# EAGLE design LRA_FlightComputerV (EAGLE 8.7.1)
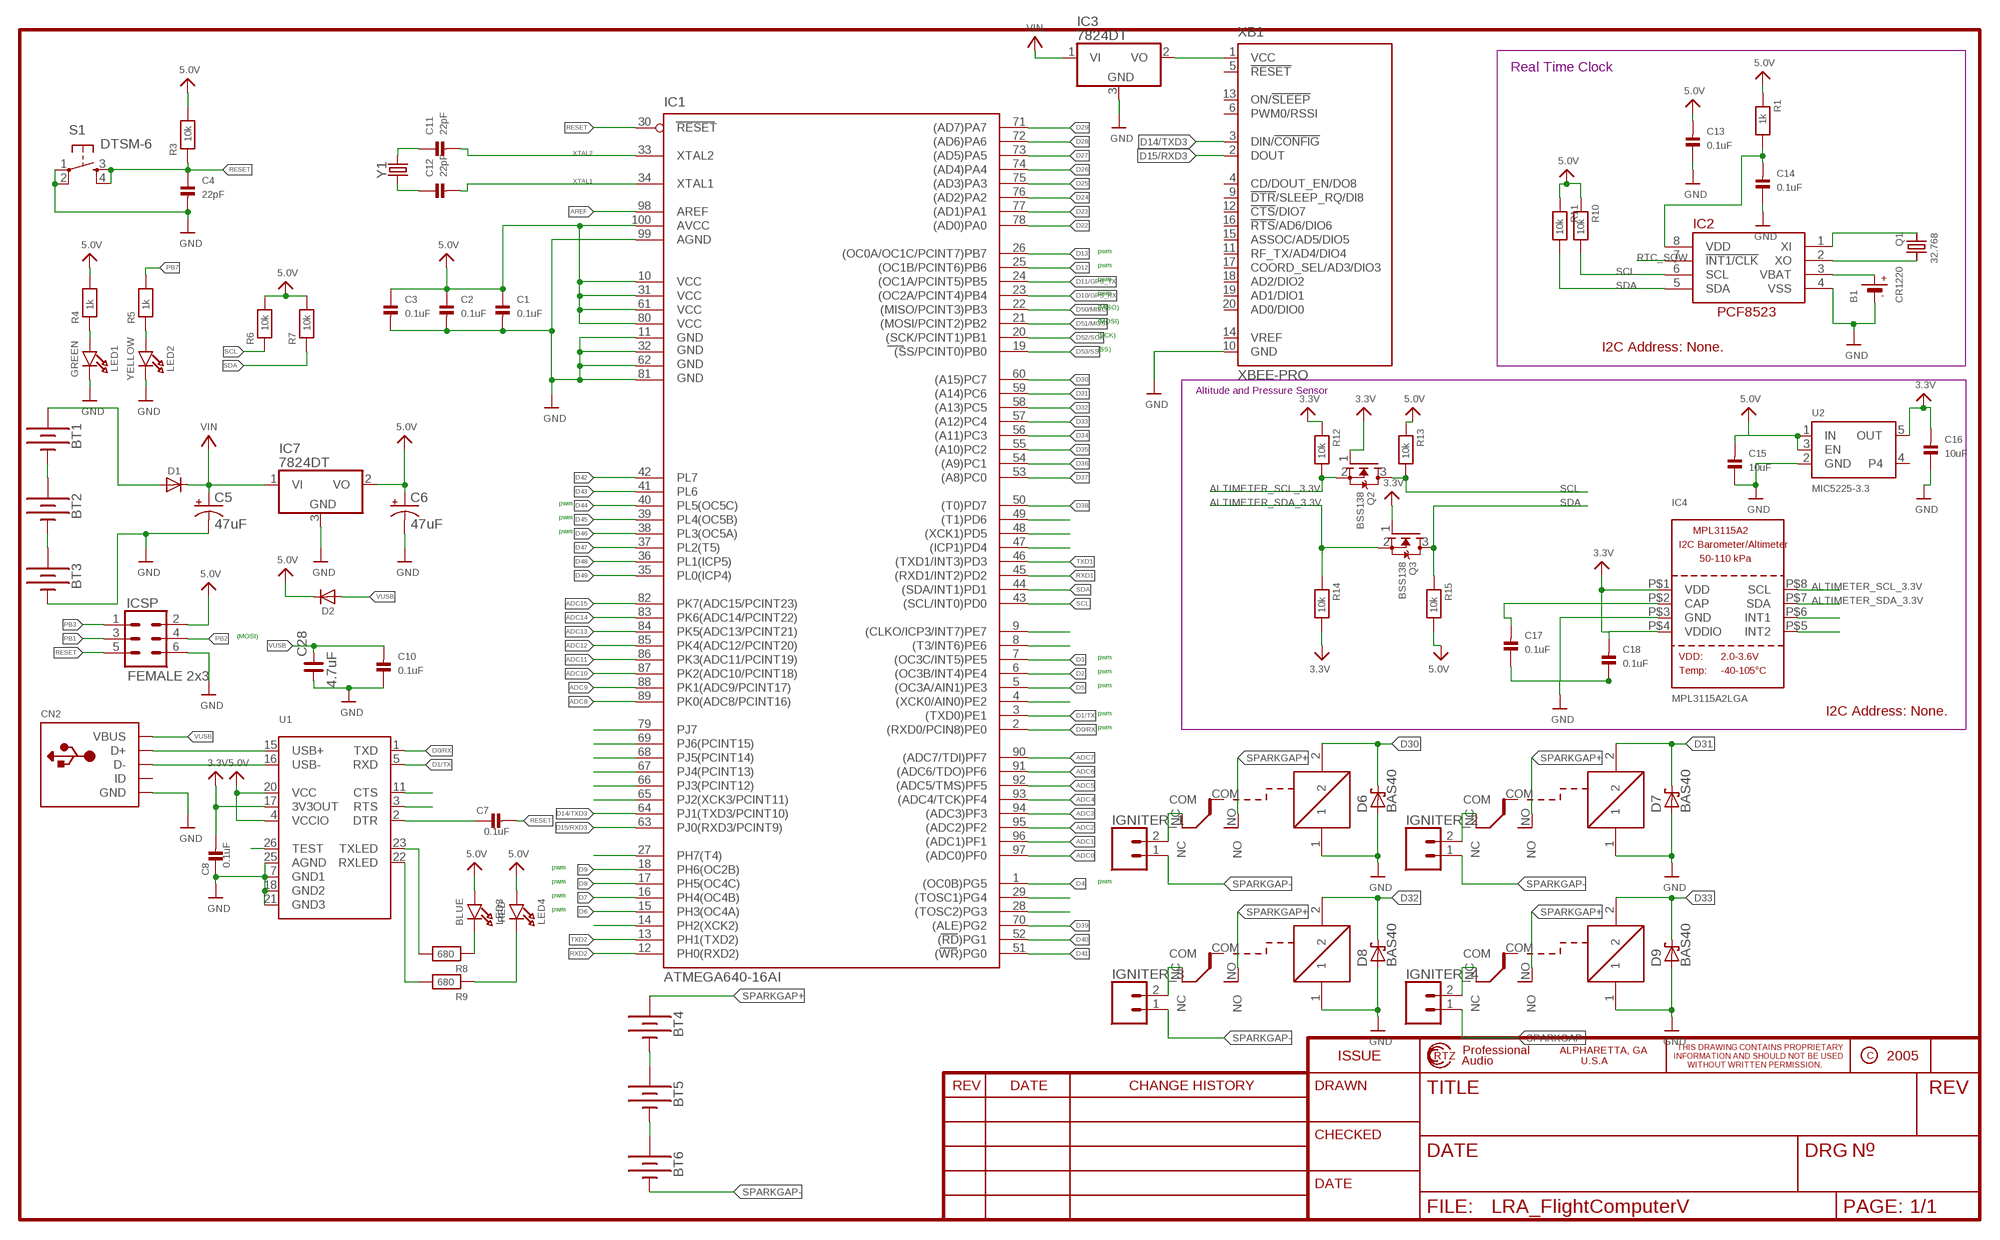
[diagram p0: schematic, sheet 1, part 1 of 2]
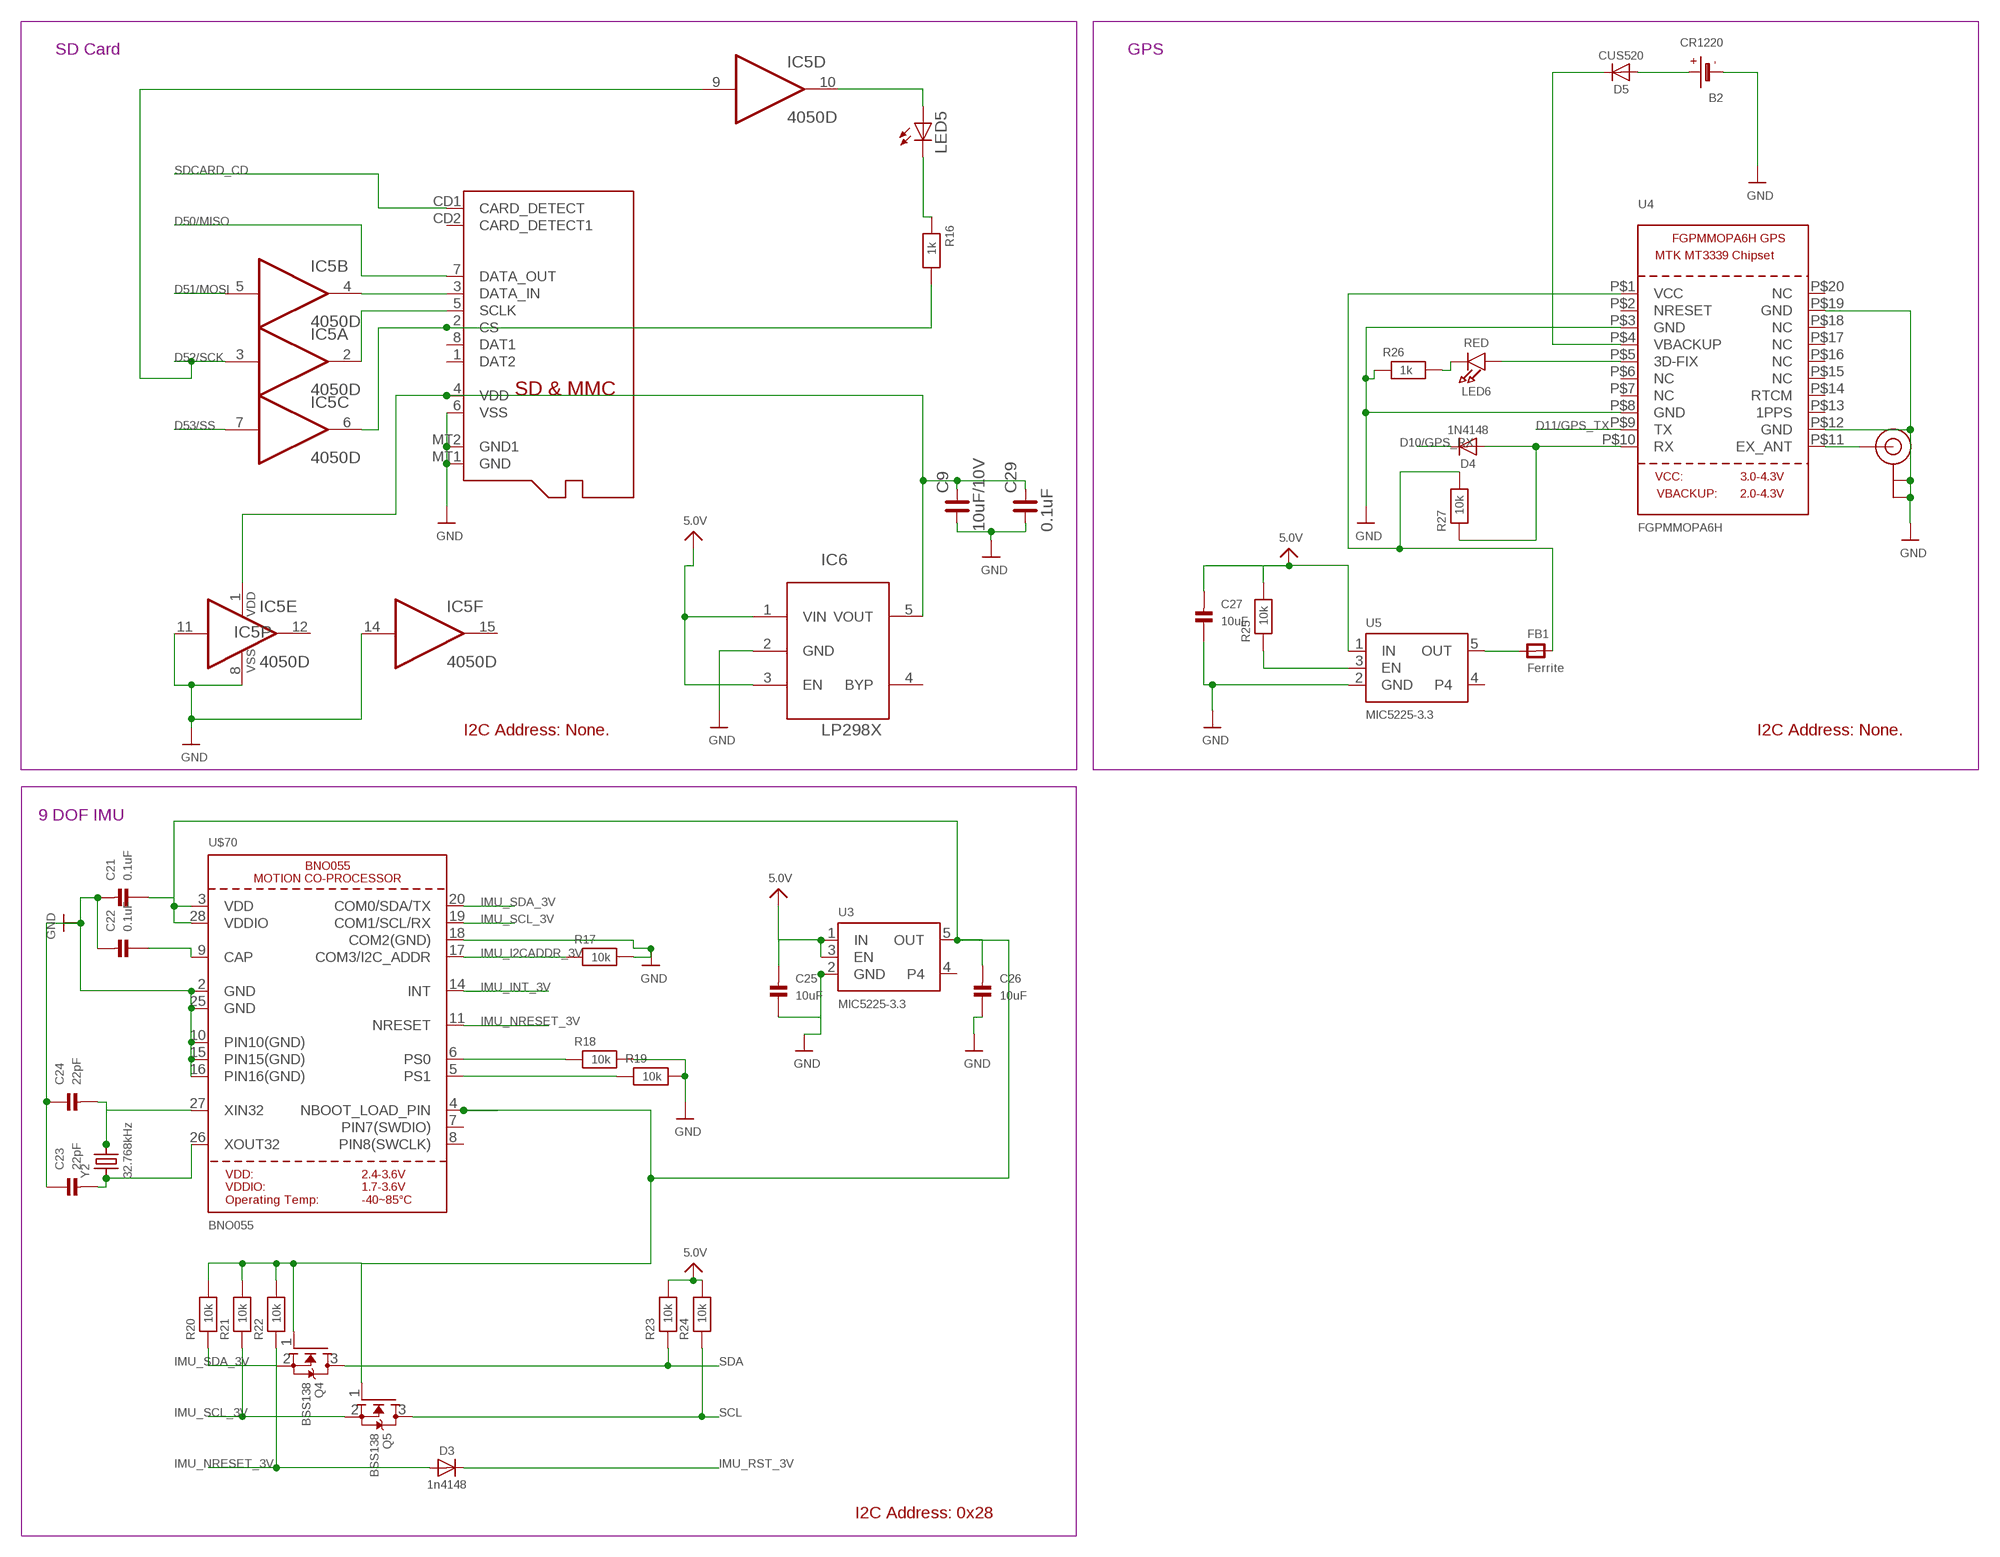
[diagram p1: schematic, sheet 1, part 2 of 2]

## Parts
B1  CR1220  BATTERYCR1220_SMT  [CR1220]
B2  CR1220  BATTERYCR1220_SMT  [CR1220]
BT1  BATTERY-18650  [BATTERY_18650-HOLDER]
BT2  BATTERY-18650  [BATTERY_18650-HOLDER]
BT3  BATTERY-18650  [BATTERY_18650-HOLDER]
BT4  BATTERY-18650  [BATTERY_18650-HOLDER]
BT5  BATTERY-18650  [BATTERY_18650-HOLDER]
BT6  BATTERY-18650  [BATTERY_18650-HOLDER]
C1  0.1uF  CAP_CERAMIC0805  [0805@1]
C2  0.1uF  CAP_CERAMIC0805  [0805@1]
C3  0.1uF  CAP_CERAMIC0805  [0805@1]
C4  22pF  CAP_CERAMIC0805  [0805@1]
C5  47uF  CPOL-USD  [PANASONIC_D]
C6  47uF  CPOL-USD  [PANASONIC_D]
C7  0.1uF  CAP_CERAMIC0805  [0805@1]
C8  0.1uF  CAP_CERAMIC0805  [0805@1]
C9  10uF/10V  C_0805  [C0805]
C10  0.1uF  CAP_CERAMIC0805  [0805@1]
C11  22pF  CAP_CERAMIC0805  [0805@1]
C12  22pF  CAP_CERAMIC0805  [0805@1]
C13  0.1uF  CAP_CERAMIC0805  [0805@1]
C14  0.1uF  CAP_CERAMIC0805  [0805@1]
C15  10uF  CAP_CERAMIC0805  [0805@1]
C16  10uF  CAP_CERAMIC0805  [0805@1]
C17  0.1uF  CAP_CERAMIC0805  [0805@1]
C18  0.1uF  CAP_CERAMIC0805  [0805@1]
C21  0.1uF  CAP_CERAMIC0805  [0805@1]
C22  0.1uF  CAP_CERAMIC0805  [0805@1]
C23  22pF  CAP_CERAMIC0805  [0805@1]
C24  22pF  CAP_CERAMIC0805  [0805@1]
C25  10uF  CAP_CERAMIC0805  [0805@1]
C26  10uF  CAP_CERAMIC0805  [0805@1]
C27  10uF  CAP_CERAMIC0805  [0805@1]
C28  4.7uF  C_0805  [C0805]
C29  0.1uF  C_0805  [C0805]
CN2  USBMINIB  [USB-MINIB]
D1  DIODESOD-123  [SOD-123]
D2  DIODESOD-123  [SOD-123]
D3  1n4148  DIODESOD-323  [SOD-323]
D4  1N4148  DIODESOD-323  [SOD-323]
D5  CUS520  DIODESOD-323  [SOD-323]
D6  BAS40  [SOT23]
D7  BAS40  [SOT23]
D8  BAS40  [SOT23]
D9  BAS40  [SOT23]
FB1  Ferrite  FERRITE-0805NO  [0805-NO]
IC1  ATMEGA640-16AI  [TQFP100]
IC2  RTC_PCF8523T  [SOIC8_150MIL]
IC3  7824DT  [TO252]
IC4  MPL3115A2LGA  [LGA8]
IC5  4050D  [SO16]
IC6  LP298XS  [SOT23-5L]
IC7  7824DT  [TO252]
ICSP  FEMALE 2x3  CONN_03X2FEMALE  [2X3]
IGNITER_1  CONN_02  [1X02]
IGNITER_2  CONN_02  [1X02]
IGNITER_3  CONN_02  [1X02]
IGNITER_4  CONN_02  [1X02]
LED1  GREEN  LED0805  [CHIPLED_0805]
LED2  YELLOW  LED0805  [CHIPLED_0805]
LED3  BLUE  LED0805  [CHIPLED_0805]
LED4  RED  LED0805  [CHIPLED_0805]
LED5  LEDCHIPLED_0805  [CHIPLED_0805]
LED6  RED  LED0805  [CHIPLED_0805]
Q1  32.768  CRYSTAL8.0X3.8  [CRYSTAL_8X3.8]
Q2  BSS138  MOSFET-NWIDE  [SOT23-WIDE]
Q3  BSS138  MOSFET-NWIDE  [SOT23-WIDE]
Q4  BSS138  MOSFET-NWIDE  [SOT23-WIDE]
Q5  BSS138  MOSFET-NWIDE  [SOT23-WIDE]
R1  1k  RESISTOR0805  [0805@1]
R3  10k  RESISTOR0805  [0805@1]
R4  1k  RESISTOR0805  [0805@1]
R5  1k  RESISTOR0805  [0805@1]
R6  10k  RESISTOR0805  [0805@1]
R7  10k  RESISTOR0805  [0805@1]
R8  680  RESISTOR0805  [0805@1]
R9  680  RESISTOR0805  [0805@1]
R10  10k  RESISTOR0805  [0805@1]
R11  10k  RESISTOR0805  [0805@1]
R12  10k  RESISTOR0805  [0805@1]
R13  10k  RESISTOR0805  [0805@1]
R14  10k  RESISTOR0805  [0805@1]
R15  10k  RESISTOR0805  [0805@1]
R16  1k  RESISTOR0805  [0805@1]
R17  10k  RESISTOR0805  [0805@1]
R18  10k  RESISTOR0805  [0805@1]
R19  10k  RESISTOR0805  [0805@1]
R20  10k  RESISTOR0805  [0805@1]
R21  10k  RESISTOR0805  [0805@1]
R22  10k  RESISTOR0805  [0805@1]
R23  10k  RESISTOR0805  [0805@1]
R24  10k  RESISTOR0805  [0805@1]
R25  10k  RESISTOR0805  [0805@1]
R26  1k  RESISTOR0805  [0805@1]
R27  10k  RESISTOR0805  [0805@1]
S1  DTSM-6  [DTSM-6]
U1  FT232RLSSOP28  [SSOP28DB]
U2  MIC5225-3.3  VREG_SOT23-5  [SOT23-5]
U3  MIC5225-3.3  VREG_SOT23-5  [SOT23-5]
U4  FGPMMOPA6H  GPS_FGPMMOPA6H  [FGPMMOPA6H]
U5  MIC5225-3.3  VREG_SOT23-5  [SOT23-5]
U$70  BNO055  [BNO055]
U$78  U.FL  [U.FL]
U$84  RW-SH  [RW-SH]
U$86  RW-SH  [RW-SH]
U$87  RW-SH  [RW-SH]
U$90  RW-SH  [RW-SH]
X1  MICROSD  [MICROSD]
XB1  XBEE-PRO  [XBEE-PRO]
Y1  CRYSTALPTH-HC49US  [HC49US]
Y2  32.768kHz  CRYSTAL8.0X3.8  [CRYSTAL_8X3.8]

## Nets
3.3V: C8.2 C16.2 C18.2 IC4.P$1(VDD) IC4.P$4(VDDIO) Q2.1(G) Q3.1(G) R12.1 R14.2 U1.17(3V3OUT) U2.5(OUT)
5.0V [16mil]: C1.1 C2.1 C3.1 C6.+ C13.2 C15.2 C25.2 C27.2 D2.C IC1.10(VCC) IC1.31(VCC1) IC1.61(VCC2) IC1.80(VCC3) IC1.100(AVCC) IC6.1(VIN) IC6.3(EN) IC7.2(VO) ICSP.2 LED3.A LED4.A R1.1 R3.2 R4.2 R6.2 R7.2 R10.1 R11.1 R13.1 R15.2 R23.2 R24.2 R25.2 U1.4(VCCIO) U1.20(VCC) U2.1(IN) U2.3(EN) U3.1(IN) U3.3(EN) U5.1(IN)
ADC0: IC1.97((ADC0)PF0)
ADC1: IC1.96((ADC1)PF1)
ADC2: IC1.95((ADC2)PF2)
ADC3: IC1.94((ADC3)PF3)
ADC4: IC1.93((ADC4/TCK)PF4)
ADC5: IC1.92((ADC5/TMS)PF5)
ADC6: IC1.91((ADC6/TDO)PF6)
ADC7: IC1.90((ADC7/TDI)PF7)
ADC8: IC1.89(PK0(ADC8/PCINT16))
ADC9: IC1.88(PK1(ADC9/PCINT17))
ADC10: IC1.87(PK2(ADC10/PCINT18))
ADC11: IC1.86(PK3(ADC11/PCINT19))
ADC12: IC1.85(PK4(ADC12/PCINT20))
ADC13: IC1.84(PK5(ADC13/PCINT21))
ADC14: IC1.83(PK6(ADC14/PCINT22))
ADC15: IC1.82(PK7(ADC15/PCINT23))
ALTIMETER_SCL_3.3V: IC4.P$8(SCL) Q2.2(S) R12.2
ALTIMETER_SDA_3.3V: IC4.P$7(SDA) Q3.2(S) R14.1
AREF: IC1.98(AREF)
D0/RX: IC1.2((RXD0/PCIN8)PE0) U1.1(TXD)
D1/TX: IC1.3((TXD0)PE1) U1.5(RXD)
D2: IC1.6((OC3B/INT4)PE4)
D3: IC1.7((OC3C/INT5)PE5)
D4: IC1.1((OC0B)PG5)
D5: IC1.5((OC3A/AIN1)PE3)
D6: IC1.15(PH3(OC4A))
D7: IC1.16(PH4(OC4B))
D8: IC1.17(PH5(OC4C))
D9: IC1.18(PH6(OC2B))
D10/GPS_RX: D4.C IC1.23((OC2A/PCINT4)PB4)
D11/GPS_TX: IC1.24((OC1A/PCINT5)PB5) U4.P$9(TX)
D12: IC1.25((OC1B/PCINT6)PB6)
D13: IC1.26((OC0A/OC1C/PCINT7)PB7)
D14/TXD3: IC1.64(PJ1(TXD3/PCINT10)) XB1.3(DIN/!CONFIG)
D15/RXD3: IC1.63(PJ0(RXD3/PCINT9)) XB1.2(DOUT)
D22: IC1.78((AD0)PA0)
D23: IC1.77((AD1)PA1)
D24: IC1.76((AD2)PA2)
D25: IC1.75((AD3)PA3)
D26: IC1.74((AD4)PA4)
D27: IC1.73((AD5)PA5)
D28: IC1.72((AD6)PA6)
D29: IC1.71((AD7)PA7)
D30: D6.3(C) IC1.60((A15)PC7) U$87.2
D31: D7.3(C) IC1.59((A14)PC6) U$84.2
D32: D8.3(C) IC1.58((A13)PC5) U$86.2
D33: D9.3(C) IC1.57((A12)PC4) U$90.2
D34: IC1.56((A11)PC3)
D35: IC1.55((A10)PC2)
D36: IC1.54((A9)PC1)
D37: IC1.53((A8)PC0)
D38: IC1.50((T0)PD7)
D39: IC1.70((ALE)PG2)
D40: IC1.52((RD)PG1)
D41: IC1.51((WR)PG0)
D42: IC1.42(PL7)
D43: IC1.41(PL6)
D44: IC1.40(PL5(OC5C))
D45: IC1.39(PL4(OC5B))
D46: IC1.38(PL3(OC5A))
D47: IC1.37(PL2(T5))
D48: IC1.36(PL1(ICP5))
D49: IC1.35(PL0(ICP4))
D50/MISO: IC1.22((MISO/PCINT3)PB3) X1.7(DATA_OUT)
D51/MOSI: IC1.21((MOSI/PCINT2)PB2) IC5.5(B:I)
D52/SCK: IC1.20((SCK/PCINT1)PB1) IC5.3(A:I) IC5.9(D:I)
D53/SS: IC1.19((SS/PCINT0)PB0) IC5.7(C:I)
GND [24mil]: B1.- B2.- BT3.GND@1(-) C1.2 C2.2 C3.2 C4.2 C5.- C6.- C8.1 C9.1 C10.1 C13.1 C14.1 C15.1 C16.1 C17.1 C18.1 C21.2 C22.2 C23.1 C24.1 C25.1 C26.1 C27.1 C28.1 C29.1 CN2.GND D6.1(A) D7.1(A) D8.1(A) D9.1(A) IC1.11(GND) IC1.32(GND1) IC1.62(GND2) IC1.81(GND3) IC1.99(AGND) IC2.4(VSS) IC3.3(GND) IC4.P$3(GND) IC5.8(P:VSS) IC5.11(E:I) IC5.14(F:I) IC6.2(GND) IC7.3(GND) ICSP.6 LED1.C LED2.C R17.2 R18.2 R19.2 R26.1 S1.1 S1.2 U1.7(GND1) U1.18(GND2) U1.21(GND3) U1.25(AGND) U2.2(GND) U3.2(GND) U4.P$3(GND) U4.P$8(GND) U4.P$12(GND) U4.P$19(GND) U5.2(GND) U$70.2(GND) U$70.10(PIN10(GND)) U$70.15(PIN15(GND)) U$70.16(PIN16(GND)) U$70.18(COM2(GND)) U$70.25(GND) U$78.P$1(GND) U$78.P$2(GND) U$84.1 U$86.1 U$87.1 U$90.1 X1.6(VSS) X1.MT1(GND) X1.MT2(GND1) XB1.10(GND)
IMU_I2CADDR_3V: R17.1 U$70.17(COM3/I2C_ADDR)
IMU_INT_3V: U$70.14(INT)
IMU_NRESET_3V: D3.A R22.1 U$70.11(NRESET)
IMU_RST_3V: D3.C
IMU_SCL_3V: Q5.2(S) R21.1 U$70.19(COM1/SCL/RX)
IMU_SDA_3V: Q4.2(S) R20.1 U$70.20(COM0/SDA/TX)
N$1: IC1.65(PJ2(XCK3/PCINT11))
N$2: IC1.66(PJ3(PCINT12))
N$4: IC1.67(PJ4(PCINT13))
N$5: IC1.68(PJ5(PCINT14))
N$6: IC1.69(PJ6(PCINT15))
N$7: IC1.79(PJ7)
N$8: IC1.27(PH7(T4))
N$9: IC1.9((CLKO/ICP3/INT7)PE7)
N$10: IC1.49((T1)PD6)
N$11: IC1.48((XCK1)PD5)
N$12: IC1.47((ICP1)PD4)
N$13: IC1.14(PH2(XCK2))
N$14: IC1.8((T3/INT6)PE6)
N$15: BT2.GND@1(-) BT3.PWR@1(+)
N$16: CN2.D+ U1.15(USB+)
N$17: CN2.D- U1.16(USB-)
N$18: IC1.4((XCK0/AIN0)PE2)
N$19: LED1.A R4.1
N$20: LED2.A R5.1
N$21: LED3.C R8.1
N$22: R9.2 U1.22(RXLED)
N$23: R8.2 U1.23(TXLED)
N$24: LED4.C R9.1
N$25: IC1.29((TOSC1)PG4)
N$26: IC1.28((TOSC2)PG3)
N$27: C11.1 Y1.2
N$28: U1.26(TEST)
N$29: U1.11(CTS)
N$30: U1.3(RTS)
N$31: C7.1 U1.2(DTR)
N$32: C12.1 Y1.1
N$33: C14.2 IC2.8(VDD) R1.2
N$34: IC5.4(B:O) X1.3(DATA_IN)
N$35: C17.2 IC4.P$2(CAP)
N$36: IC5.2(A:O) X1.5(SCLK)
N$37: IC4.P$6(INT1)
N$38: IC2.1(XI) Q1.P$1
N$39: IC2.2(XO) Q1.P$4
N$40: B1.+$1(+) B1.+$2(+) IC2.3(VBAT)
N$41: IC4.P$5(INT2)
N$42: IC5.6(C:O) R16.2 X1.2(CS)
N$43: LED5.C R16.1
N$44: IC5.10(D:O) LED5.A
N$45: C24.2 U$70.27(XIN32) Y2.P$4
N$46: C22.1 U$70.9(CAP)
N$47: C23.2 U$70.26(XOUT32) Y2.P$1
N$48: R18.1 U$70.6(PS0)
N$49: R19.1 U$70.5(PS1)
N$50: R25.1 U5.3(EN)
N$51: LED6.C R26.2
N$52: FB1.2 R27.2 U4.P$1(VCC)
N$53: U4.P$11(EX_ANT) U$78.P$3(SIGNAL)
N$54: D5.C U4.P$4(VBACKUP)
N$55: B2.+$1(+) B2.+$2(+) D5.A
N$56: D4.A R27.1 U4.P$10(RX)
N$57: LED6.A U4.P$5(3D-FIX)
N$58: BT1.GND@1(-) BT2.PWR@1(+)
N$59: BT4.GND@1(-) BT5.PWR@1(+)
N$60 [32mil]: BT1.PWR@1(+) D1.A
N$61: BT5.GND@1(-) BT6.PWR@1(+)
N$62 [32mil]: IGNITER_1.2 U$87.NC
N$63: IC3.2(VO) XB1.1(VCC)
N$64 [32mil]: IGNITER_2.2 U$84.NC
N$65: IGNITER_3.2 U$86.NC
N$66 [32mil]: IGNITER_4.2 U$90.NC
OUT: C21.1 C26.2 FB1.1 Q4.1(G) Q5.1(G) R20.2 R21.2 R22.2 U3.5(OUT) U5.5(OUT) U$70.3(VDD) U$70.4(NBOOT_LOAD_PIN) U$70.28(VDDIO)
PB1: ICSP.3
PB2: ICSP.4
PB3: ICSP.1
PB7: R5.2
RESET: C4.1 C7.2 IC1.30(RESET) ICSP.5 R3.1 S1.3 S1.4
RTC_SQW: IC2.7(!INT1/CLK)
RXD1: IC1.45((RXD1/INT2)PD2)
RXD2: IC1.12(PH0(RXD2))
SCL: IC1.43((SCL/INT0)PD0) IC2.6(SCL) Q2.3(D) Q5.3(D) R6.1 R10.2 R13.2 R24.1
SDA: IC1.44((SDA/INT1)PD1) IC2.5(SDA) Q3.3(D) Q4.3(D) R7.1 R11.2 R15.1 R23.1
SDCARD_CD: X1.CD1(CARD_DETECT)
SPARKGAP+ [32mil]: BT4.PWR@1(+) U$84.NO U$86.NO U$87.NO U$90.NO
SPARKGAP- [32mil]: BT6.GND@1(-) IGNITER_1.1 IGNITER_2.1 IGNITER_3.1 IGNITER_4.1
TXD1: IC1.46((TXD1/INT3)PD3)
TXD2: IC1.13(PH1(TXD2))
VDD: C9.2 C29.2 IC5.1(P:VDD) IC6.5(VOUT) X1.4(VDD)
VIN [16mil]: C5.+ D1.C IC3.1(VI) IC7.1(VI)
VUSB: C10.2 C28.2 CN2.VBUS D2.A
XTAL1: C12.2 IC1.34(XTAL1)
XTAL2: C11.2 IC1.33(XTAL2)
Unconnected: CN2.ID IC5.12(E:O) IC5.15(F:O) IC6.4(BYP) U2.4 U3.4 U4.P$2(NRESET) U4.P$6(NC) U4.P$7(NC) U4.P$13(1PPS) U4.P$14(RTCM) U4.P$15(NC) U4.P$16(NC) U4.P$17(NC) U4.P$18(NC) U4.P$20(NC) U5.4 U$70.7(PIN7(SWDIO)) U$70.8(PIN8(SWCLK)) U$84.COM U$86.COM U$87.COM U$90.COM X1.1(DAT2) X1.8(DAT1) X1.CD2(CARD_DETECT1) XB1.4(CD/DOUT_EN/DO8) XB1.5(!RESET) XB1.6(PWM0/RSSI) XB1.9(!DTR!/SLEEP_RQ/DI8) XB1.11(RF_TX/AD4/DIO4) XB1.12(!CTS!/DIO7) XB1.13(ON/!SLEEP) XB1.14(VREF) XB1.15(ASSOC/AD5/DIO5) XB1.16(!RTS!/AD6/DIO6) XB1.17(COORD_SEL/AD3/DIO3) XB1.18(AD2/DIO2) XB1.19(AD1/DIO1) XB1.20(AD0/DIO0)

## Notes on the sheet
- Real Time Clock | SD Card | GPS
- pwm
- pwm
- pwm
- pwm
- (MISO)
- (MOSI)
- (SCK)
- (SS) | I2C Address: None.
- Altitude and Pressure Sensor
- pwm
- pwm
- pwm
- I2C Address: None. | I2C Address: None.
- (MOSI)
- pwm
- pwm
- pwm
- 9 DOF IMU
- pwm | I2C Address: None.
- pwm
- pwm
- pwm | pwm
- pwm
- pwm
- I2C Address: 0x28

## Library data of the parts
B1 B2 = microbuilder:BATTERY: CR1220 SMT - Digikey: 3001K-ND CD2032 BAT-HLD-001 - Digikey: BAT-HLD-001-ND
BT1-BT6 = SparkFun-Batteries:BATTERY: Battery - Single Cell A variety of battery chemistries, sizes, and footprints. Device List: 20MM_PTH - Coin Cell Battery Holder - 20mm (PTH) <https://www.sparkfun.com/products/783> 6.8MM_PTH - Coin Cell Battery Holder - 6.8MM(SMD) <https://www.digikey.com/product-detail/en/seiko-instruments/MS621FE-FL11E/728-1057-ND/1889208?WT.srch=1&gclid=CNOQ5a6LzdQCFZS2wAodXCkE0g> 12MM_SMD - Coin Cell Battery Holder - 12mm (SMD) <https://www.sparkfun.com/products/10592> 12MM_PTH - Coin Cell Battery Holder - 12mm (PTH) <https://www.sparkfun.com/products/7948> 20MM_SMD - 20mm Coin Cell Battery Holder (SMD) (2 legs) Used on the Big Time Watch Kit <https://www.sparkfun.com/products/11734> 20MM_SMD_4LEGS - Coin Cell Battery Holder - 20mm (SMD) <https://www.sparkfun.com/products/11892> 20MM_SMD_4LEGS_OVERPASTE - Coin Cell Battery Holder - 20mm (SMD) <https://www.sparkfun.com/products/11892> (Over-paste on the legs) 24.5MM_PTH - Coin Cell Battery Holder - 24.5mm (PTH) <https://www.sparkfun.com/products/8863> 9V - 9V Battery Holder - PC Mount Used on the SparkFun SparkPunk Sound Kit <https://www.sparkfun.com/products/11177> and SparkFun SparkPunk Sequencer Kit <https://www.sparkfun.com/products/12707> 18650 - Battery Holder - 18650 (PTH) <https://www.sparkfun.com/products/13113> AA - Battery Holder - 1xAA (PTH) <https://www.sparkfun.com/products/7949> AAA - Battery Holder - 1xAAA (PTH) <https://www.sparkfun.com/products/12718> AA_KIT - Battery Holder - 1xAA (PTH) <https://www.sparkfun.com/products/7949> Special kit package - pads only have exposed copper on one side of the board. AAA_KIT - Battery Holder - 1xAAA (PTH) <https://www.sparkfun.com/products/12718> Special kit package - pads only have exposed copper on one side of the board.; PROD_ID: BATT-12327; SF_SKU: PRT-13113
C1-C4 C7 C8 C10-C18 C21-C27 = microbuilder:CAP_CERAMIC: Ceramic Capacitors 0402 - 0402 Surface Mount Capacitors 16pF 50V 5% [Digikey: 445-4899-2-ND] 18pF 50V 5% [Digikey: 490-1281-2-ND] 22pF 50V 5% [Digikey: 490-1283-2-ND] 68pF 50V 5% [Digikey: 490-1289-2-ND] 0.1uF 10V 10% [Digikey: 490-1318-2-ND] 1.0uF 6.3V 10% [Digikey: 490-1320-2-ND] 0603 - 0603 Surface Mount Capacitors 16 pF 50V 5% [Digikey: 445-5051-2-ND] 22 pF 50V [Digikey: PCC220ACVTR-ND] 33 pF 50V 5% [Digikey: 490-1415-1-ND] 56pF 50V 5% [Digikey: 490-1421-1-ND] 220pF 50V 5% [Digikey: 445-1285-1-ND] 680 pF 50V 2200 pF 50V 5% C0G [Digikey: 445-1297-1-ND] 5600 pF 100V 5% X7R [Digikey: 478-3711-1-ND] 0.1 µF 25V 10% [Digikey: PCC2277TR-ND] 0.22 µF 16V 10% X7R [Digikey: 445-1318-1-ND] 1.0 µF 25V 10% [Digikey: 445-5146-2-ND] 0603 - RF Specific 3pF 250V +/-0.1pF RF [Digikey: 712-1347-1-ND] 18 pF 250V 5% [Digikey: 478-3505-1-ND or 712-1322-1-ND] 56 pF 250V 5% C0G RF [Digikey: 490-4867-1-ND] 68 pF 250V RF [Digikey: 490-4868-1-ND] 0805 - 0805 Surface Mount Capacitors 220 pF 250V 2% RF Ceramic Capacitor [Digikey: 712-1398-1-ND] 1000 pF 50V 2% NP0 Ceramic Capacitor [Digikey: 478-3760-1-ND] 0.1 µF 25V 10% Ceramic Capacitor [Digikey: PCC1828TR-ND] 1.0 µF 16V 10% Ceramic Capacitor[Digikey: 490-1691-2-ND] 10.0 µF 10V 10% Ceramic Capacitor[Digikey: 709-1228-1-ND] 10.0 uF 16V 10% Ceramic Capacitor [Digikey: 478-5165-2-ND] 47 uF 6.3V 20% Ceramic Capacitor [Digikey: 587-1779-1-ND or 399-5506-1-ND] 1206 - 1206 Surface Mount Capacitors 47uF 10V 20% Ceramic Capacitor [Digikey: 490-5528-1-ND or 399-5508-1-ND or 445-6010-1-ND]
C5 C6 = rcl:CPOL-US: POLARIZED CAPACITOR, American symbol; SPICEPREFIX: C
C9 C28 C29 = rc-master-smd:C_: NON-POLARIZED CAP
CN2 = adafruit:USB: USB Connectors USBMINIB - Surface Mount Female Mini-B USB Connector 4UConnector: 06564 By microbuilder.eu Thru-hole RA Female Mini-B USB Connector 4UConnector: 18732 By ladyada.net
D1-D5 = microbuilder:DIODE: Diode SMA Model Volts Amps Type Vf Ir Digikey # Notes SSA34-E3 40V 3A Schottky 480mV @ 3A 200uA @ 40V SSA34-E3/61TGITR-ND CDBA120-G 20V 1A Schottky 500mV @ 1A 500uA @ 20V 641-1014-6-ND REEL MBRA210 10V 2A Schottky 350mV @ 2A 700uA @ 10V MBRA210LT3 SOD-123 Model Volts Amps Type Vf Ir Order # Notes BAT54T1G 30V 200mA Schottky 800mV @ 200mA 2uA @ 25V BAT54T1GOSTR-ND B0530W 30V 500mA Schottky 430mV @ 500mA 130uA @ 30V B0530W-FDICT-ND REEL MBR120 20V 1A Schottky 340mV @ 1A MBR120VLSFT1GOSCT-ND SOD-323 Model Volts Amps Type Vf Ir Order # Notes PMEG2005EJ 20V 500mA Schottky 355mV @ 500mA 568-4110-1-ND ZLLS410 10V 570mA Schottky 380mV @ 570mA ZLLS410CT-ND 1N4148WS 75V 150mA Silicon/Simple 1V 1N4148WSFSCT-ND REEL SOD-523 Model Volts Amps Type Vf Ir Order # Notes BAT54XV2 30V 200mA Schottky 0.8V @ 100mA BAT54XV2CT-ND TB751S 30V 30mA Schottky RB751S-40TE61CT-ND SOT23-R/W (R = Solder Paste/Reflow Ovens, W = Hand-Soldering) Model Volts Amps Type Vf Ir Order # Notes BAT54FILM 40V 300mA Schottky 497-7162-1-ND POWERDI-5 Model Volts Amps Type Vf Ir Order # Notes PDS560 60V 5A Schottky 670mV @ 5A 150uA @ 60V PDS560DICT-ND
D6-D9 = diode:BAS40: Silicon Schottky Diodes General-purpose diode for high-speed switching
FB1 = microbuilder:FERRITE: Ferrite Bead 0603 MMZ1608B121C - 120 Ohm @ 100MHz, 600mA, 0.15 Ohm DC Resistance - Digikey: 445-2164-1-ND BK1608HW121-T - 120 Ohm, 600mA Ferrite Chip - Digikey: 587-1876-2-ND 0805 HZ0805B272R-10 - 2.7K Ohm @ 100MHz, 200mA, 0.8 Ohm DC Resistance - Digikey: 240-2504-1-ND (see also Murata BLM21BD272SN1L) MMZ2012Y152B - 1.5K Ohm @ 100MHz, 500mA, 0.4 Ohm DC Resistance - Digikey: 445-1560-1-ND - Mainly for high frequency (80-400MHz) MMZ2012R102A - 1K Ohm @ 100MHz, 500mA, 0.3 Ohm DC Resistance - Digikey: 445-1555-2-ND - More general purpose (10-200MHz)
IC1 = atmel-2005:ATMEGA*: MICROCONTROLLER 64/128/256 Kbytes FLASH 4 Kbytes EEPROM 8 Kbytes SRAM 86 General Purpose I/O pins 12-channels16-bit PWM 4 x Serial USARTs 16-channels 10-bit A/D
IC2 = microbuilder:RTC_PCF8523
IC3 IC7 = adafruit:78*: Positive VOLTAGE REGULATOR Added bigger pads to the TO-92 package
IC4 = microbuilder:MPL3115A2
IC5 = 40xx:4050: Hex non-inverting BUFFER
IC6 = adafruit:LP298X
ICSP = SparkFun-Connectors:CONN_03X2: Multi connection point. Often used as Generic Header-pin footprint for 0.1 inch spaced/style header connections You can populate with any combo of single row headers, but if you'd like an exact match, check these: Header - 2x3 (Male, 0.1") <https://www.sparkfun.com/products/12807> (PRT-12807) Header - 2x3 (Female, 0.1") <https://www.sparkfun.com/products/13010> (PRT-13010) 2x3 Pin Shrouded Header <https://www.sparkfun.com/products/10877> (PRT-10877) On any of the 0.1 inch spaced packages, you can populate with these: Break Away Headers - Straight <https://www.sparkfun.com/products/116> (PRT-00116) Break Away Male Headers - Right Angle <https://www.sparkfun.com/products/553> (PRT-00553) Female Headers <https://www.sparkfun.com/products/115> (PRT-00115) Break Away Headers - Machine Pin <https://www.sparkfun.com/products/117> (PRT-00117) Break Away Female Headers - Swiss Machine Pin <https://www.sparkfun.com/products/743> (PRT-00743) Special note: the shrouded connector mates well with our 3x2 ribbon cables: Ribbon Crimp Connector - 6-pin (2x3, Female) <https://www.sparkfun.com/products/10651> (PRT-10651) Ribbon Cable - 6 wire (15ft) <https://www.sparkfun.com/products/10646> (PRT-10646); PROD_ID: CONN-11566
IGNITER_1-IGNITER_4 = SparkFun-Connectors:CONN_02: Multi connection point. Often used as Generic Header-pin footprint for 0.1 inch spaced/style header connections On any of the 0.1 inch spaced packages, you can populate with these: Break Away Headers - Straight <https://www.sparkfun.com/products/116> (PRT-00116) Break Away Male Headers - Right Angle <https://www.sparkfun.com/products/553> (PRT-00553) Female Headers <https://www.sparkfun.com/products/115> (PRT-00115) Break Away Headers - Machine Pin <https://www.sparkfun.com/products/117> (PRT-00117) Break Away Female Headers - Swiss Machine Pin <https://www.sparkfun.com/products/743> (PRT-00743) For SCREWTERMINALS and SPRING TERMINALS visit here: Screw Terimnals on SparkFun.com <https://www.sparkfun.com/search/results?term=Screw+Terminals> (5mm/3.5mm/2.54mm spacing) This device is also useful as a general connection point to wire up your design to another part of your project. Our various solder wires solder well into these plated through hole pads. Hook-Up Wire - Assortment (Stranded, 22 AWG) <https://www.sparkfun.com/products/11375> (PRT-11375) Hook-Up Wire - Assortment (Solid Core, 22 AWG) <https://www.sparkfun.com/products/11367> (PRT-11367) View the entire wire category on our website here <https://www.sparkfun.com/categories/141> Special notes: Molex polarized connector foot print use with: PRT-08233 with associated crimp pins and housings. 2.54_SCREWTERM for use with PRT-10571. 3.5mm Screw Terminal footprints for PRT-08084 5mm Screw Terminal footprints for use with PRT-08432
LED1-LED4 LED6 = microbuilder:LED: LED
LED5 = adafruit:LED: LED
Q1 Y2 = microbuilder:CRYSTAL: Crystals HC49UP - Surface Mount Crystal 4.0MHz 18pF +/-30ppm Surface Mount Crystal [Digikey: 535-9857-1-ND] 12.0 MHz Surface Mount Crystal [Digikey: 535-9869-6-ND] 25.0 MHz Surface Mount Crystal [Digikey: 535-9078-1-ND] 2.5 x 2.0mm - MEMs SMT Crystal 16.0 MHz 10pF 20ppm 2.5 x 2.0mm Crystal [Digikey -40-85°C: 535-10923-1-ND] 3.2 x 2.5mm - MEMs SMT Crystal 12.0 MHz 8pF 15ppm 3.2 x 2.5mm Crystal [Digikey: -10-70°C: 644-1047-1-ND -40-125°C: 644-1128-1-ND] 40~85°C cheaper: 644-1173-6-ND 16.0 MHz 8pF 15ppm 3.2 x 2.5mm Crystal [Digikey: -10-70°C: 644-1049-1-ND -40-125°C: 644-1129-2-ND]-40~85°C cheaper: 644-1175-6-ND 16.0 MHz 10pF 10ppm 3.2 x 2.5mm Crystal [Digikey: 644-1100-1-ND] 27.12 MHz 18pF 30ppm 3.2 x 2.5mm Crystal [Digikey: 887-1424-1-ND] 27.12MHz 10pF 10ppm 3.2 x 2.5mm Crystal [Digikey: 887-1329-1-ND] 4.9 x 1.8mm - MEMs SMT Crystal 32.768 KHz 12.5pF 20ppm 4.9 x 1.8mm Crystal [Digikey: SE2415CT-ND] 8.0 x 3.8mm - Surface Mount Crystal 32.768kHz 12.5pF 20ppm -40°C-85°C [Digikey: 535-9166-2-ND] Cylinder 32.768KHz Cylinder Crystal (2x6mm body) [Ex. Digikey: 300-8341-2-ND]
Q2-Q5 = microbuilder:MOSFET-N: N-Channel Mosfet LEGEND VDS: Voltage Drain-Source ID: Drain Current RDS(ON): Drain-Source On-State Resistance VGS(TH): Gate-Source Threshold Voltage CISS: Drain-Source Input Capacitance SOT-23 Name VDS ID RDS(ON) VGS(TH) CISS Order Number 2N7002E 60V 260mA 2.5 Ohm 2.5V @ 250uA 26.7pF @ 25V 2N7002ET1GOSTR-ND BSH103 30V 850mA 400 mOhm 400mV @ 1mA 83pF @ 24V BSH103,235-ND BSS138 60V 320mA 1.6 Ohm 1.5V @ 250uA 50pF @ 10V Mouser: 771-BSS138PW115 DMN2075U-7 20V 4.2A 38 mOhm 1V @ 250 uA 594.3pF @ 10V DMN2075U-7DICT-ND * BSS138 good choice for I2C level-shifting POWERPAK 1212-8 Name VDS ID RDS(ON) VGS(TH) CISS Order Number Si7308DN 60V 6A 58 mOhm 3V @ 250uA 665pF @ 15V SI7308DN-T1-E3CT-ND
R1 R3-R27 = microbuilder:RESISTOR: Resistors 0402 - 0402 Surface Mount Package 22 Ohm 1% 1/16W [Digikey: 311-22.0LRTR-ND] 33 Ohm 5% 1/16W 1.0K 5% 1/16W 1.5K 5% 1/16W 2.0K 1% 1/16W 10.0K 1% 1/16W [Digikey: 311-10.0KLRTR-ND] 10.0K 5% 1/16W [Digikey: RMCF0402JT10K0TR-ND] 12.1K 1% 1/16W [Digikey: 311-22.0LRTR-ND] 100.0K 5% 1/16W 0603 - 0603 Surface Mount Package 0 Ohm 1/10 Watt 1% Resistor 15 Ohm 1/10 Watt 1% Resistor 33 Ohm 1/10 Watt 1% Resistor 49.9 Ohm 1/10 Watt 1% Resistor 100 Ohm 1/10 Watt 1% Resistor 150 Ohm 1/10 Watt 1% Resistor 240 Ohm 1/10 Watt 1% Resistor 390 Ohm 1/10 Watt 1% Resistor 560 Ohm 1/10 Watt 1% Resistor 680 Ohm 1/10 Watt 1% Resistor 750 Ohm 1/10 Watt 1% Resistor 1.0K Ohm 1/10 Watt 1% Resistor 1.5K Ohm 1/10 Watt 1% Resistor 2.0K Ohm 1/10 Watt 1% Resistor 2.2K Ohm 1/10 Watt 1% Resistor 3.3K Ohm 1/10 Watt 1% Resistor 4.7K Ohm 1/10 Watt 1% Resistor 10.0K Ohm 1/10 Watt 1% Resistor 12.0K Ohm 1/10 Watt 1% Resistor 12.1K Ohm 1/10 Watt 1% Resistor 20.0K Ohm 1/10 Watt 1% Resistor 33.0K Ohm 1/10 Watt 1% Resistor 100.0K Ohm 1/10 Watt 1% Resistor 0805 - 0805 Surface Mount Package 0 Ohm 1/8 Watt 1% Resistor 33 Ohm 1/8 Watt 1% Resistor 100 Ohm 1/8 Watt 1% Resistor 150 Ohm 1/8 Watt 1% Resistor 200 Ohm 1/8 Watt 1% Resistor 240 Ohm 1/8 Watt 1% Resistor 330 Ohm 1/8 Watt 1% Resistor 390 Ohm 1/8 Watt 1% Resistor 470 Ohm 1/8 Watt 1% Resistor 1.0K Ohm 1/8 Watt 1% Resistor 1.5K Ohm 1/8 Watt 1% Resistor 2.0K Ohm 1/8 Watt 1% Resistor 4.7K Ohm 1/8 Watt 1% Resistor 5.1K Ohm 1/8 Watt 1% Resistor 5.6K Ohm 1/8 Watt 1% Resistor 10.0K Ohm 1/8 Watt 1% Resistor 22.0K Ohm 1/8 Watt 1% Resistor 33.0K Ohm 1/8 Watt 1% Resistor 100K Ohm 1/8 Watt 1% Resistor 1206 - 1206 Surface Mount Package 2012 - 2010 Surface Mount Package 0.11 Ohm 1/2 Watt 1% Resistor - Digikey: RHM.11UCT-ND
S1 = switch-tact:DTSM-6
U1 = microbuilder:FT232RL: FTDI FT232RL USB TO RS232 Converter Digikey: 768-1007-1-ND
U2 U3 U5 = microbuilder:VREG_SOT23-5: SOT23-5 Fixed Voltage Regulators Part Current Out V Out V In V Dropout θJA (°C/W) TJ (°C) Digikey Part No. ADP121 150mA 3.3V 3.4-5.5V 0.09V @ 150mA -- -- ADP121-AUJZ33R7CT-ND ADP121 150mA 3.0V 3.1-5.5V 0.09V @ 150mA -- -- ADP121-AUJZ30R7CT-ND ADP122 300mA 3.3V 3.4-5.5V 0.085V @ 300mA -- -- ADP122AUJZ-3.3-R7CT-ND ADP1712 300mA 3.3V 3.5-5.5V 0.17V @ 300mA -- -- ADP1712AUJZ-3.3-R7TR-ND AP7311 (Low Cost) 150mA 3.3V 3.5-6V 0.15V @ 150mA -- -- AP7311-33WG-7DICT-ND LD39015M18R 150mA 1.8V 1.9V-5.5V 0.08V @ 100mA -- -- 497-6977-1-ND LP2985A-33DBVR 150mA 3.3V 3.3-16V 0.28V @ 150mA 206 150 296-18479-1-ND MCP1824T-3302E/OT 300mA 3.3V 3.5V-6V 0.2V @ 300mA -- -- MCP1824T-3302E/OTCT-ND MIC5205-2.5YM5 TR 150mA 2.5V 2.7-16V 0.165V @ 150mA -- -- 576-1257-2-ND MIC5205-3.0YM5 TR 150mA 3.0V 3.2V-16V 0.165V @ 150mA -- -- 576-1258-2-ND MIC5205-3.3YM5 TR 150mA 3.3V 3.5V-16V 0.165V @ 150mA -- -- 576-1259-2-ND TPS780330220 150mA 3.3V+2.2V 3.6-5.5V 250mV Max -- -- 296-23332-1-ND TDA3663/N1,135 100mA 3.3V 3.5-45V 0.18V @ 50mA -- -- 568-5343-1-ND Max operating temp can be calculated using θJA, TJ (max junction temperature), and power in watts. Set the "Maximum Ambient Temperature" until it reaches TJ ("Max Junction Temperature"), which is the absolute limit for safe use of the regulator: Heat Sink Temperature Calculator <http://www.daycounter.com/Calculators/Heat-Sink-Temperature-Calculator.phtml> For example, With 12V source into a 3.3V LP2985 and a 30mA load, we are dissipating (12V-3.3V) * 0.03A = 0.261W. With a θJA of 206 °C/W, a TJ of 150°C, and 261mW we can safely use the chip without a heat sink up to 75°C (=147.1°C Junction Temperature).
U4 = microbuilder:GPS_FGPMMOPA6H: GPS Module - MTK MT3339 Chipset, -165dBm sensitivity, 22 channels, 10Hz, auto-select external antenna options
U$70 = microbuilder:BNO055: BNO055 - Motion Co-Processor
U$78 = microbuilder:U.FL: U.FL Antenna Connector
U$84 U$86 U$87 U$90 = goodsky1:RW-SH
X1 = adafruit:MICROSD: Micro-SD / Transflash card holder with SPI pinout For the 3M # 2908-05WB-MG and/or 4UCON #19656 push-push type
XB1 = maxstream:XBEE: XBee (TM) /XBee-PRO(TM) OEM RF Modules Source: MaxStream, Inc. xbee_productmanual.pdf; MPN: XBP24-AWI-001; OC_FARNELL: 1337916; OC_NEWARK: 42M2667
Y1 = SparkFun-Clocks:CRYSTAL: Crystals (Generic) These are passive quartz crystals, which can be used as a clock source for a microcontroller. Crystal's are two-terminal devices. They require external "load" capacitors to generate an oscillating signal.

## Net classes
0 default: width 0.203 mm, clearance 0.051 mm
1 16mil: width 0.406 mm, clearance 0.051 mm
2 24mil: width 0.406 mm, clearance 0.051 mm
3 32mil: width 0.61 mm, clearance 0.051 mm

## Board
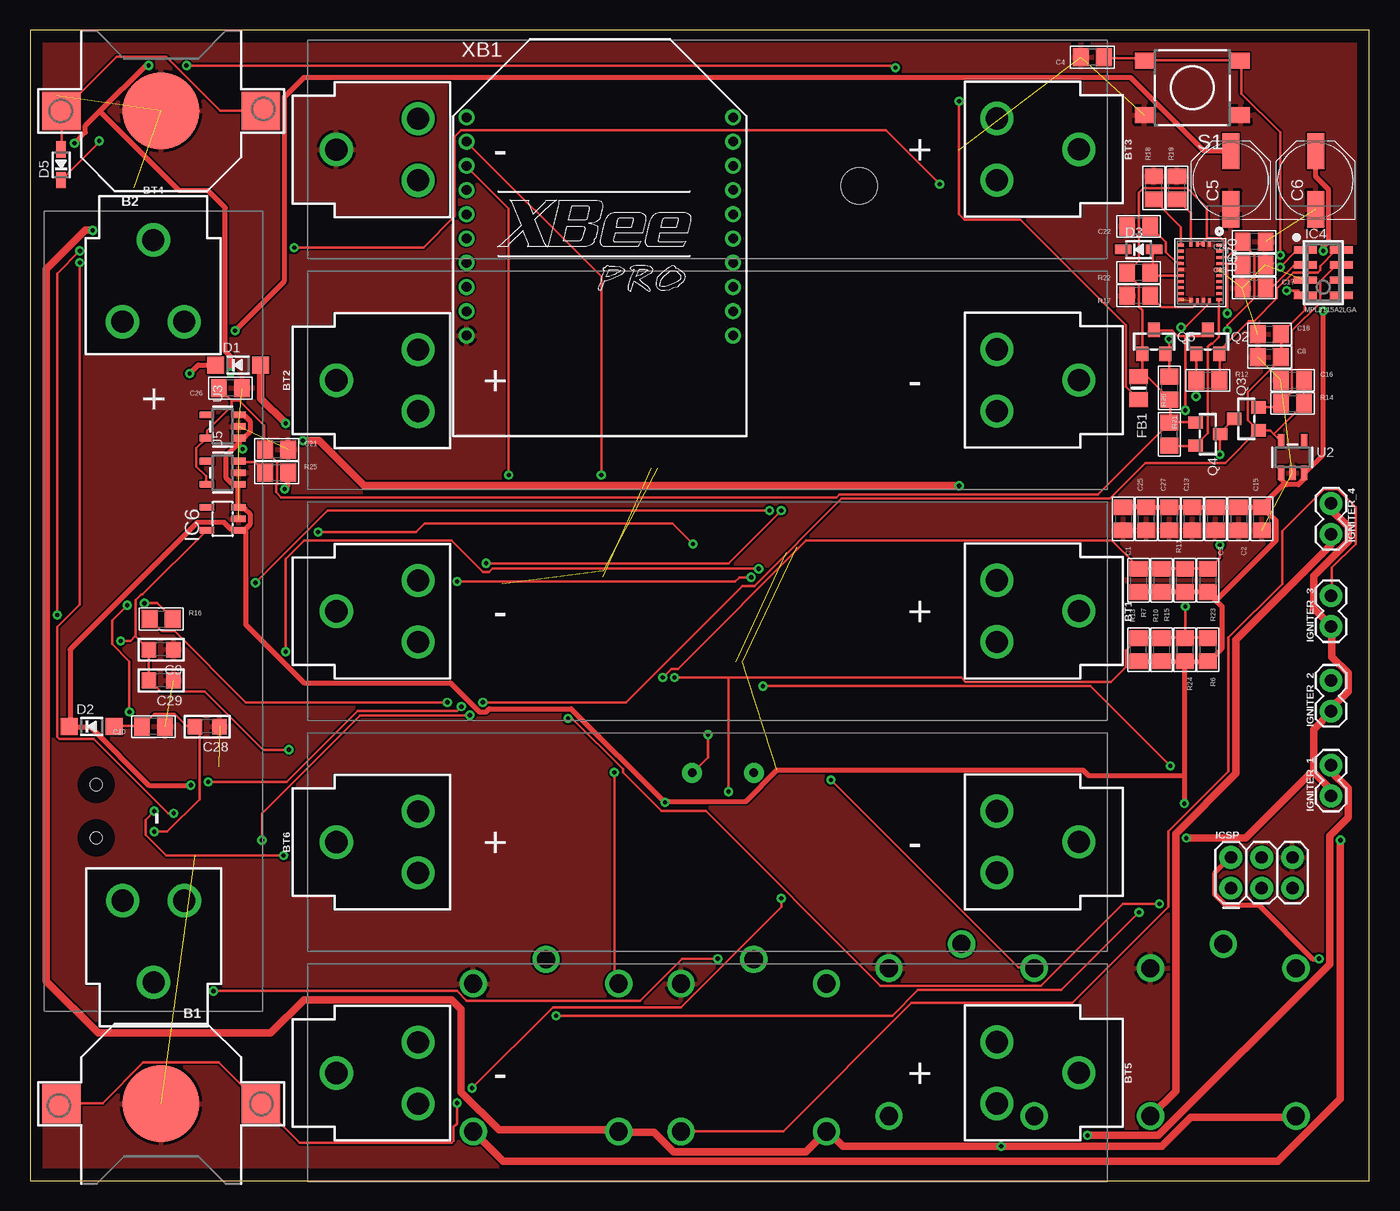
[diagram p2: board, top side]
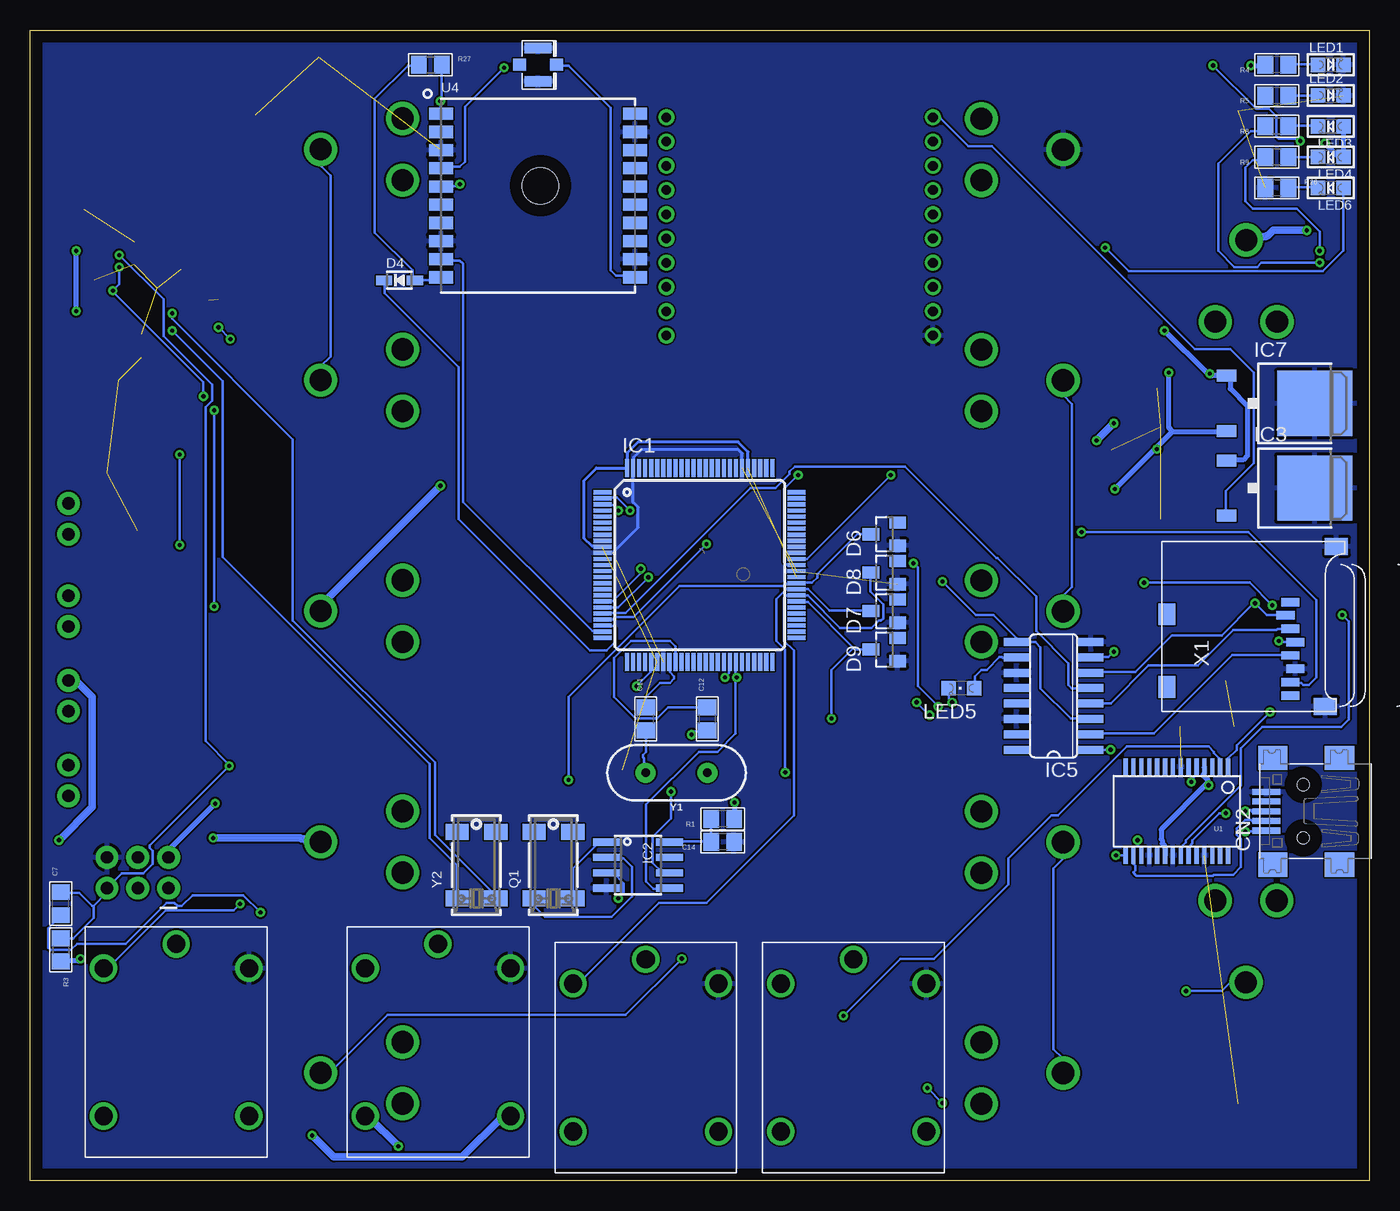
[diagram p3: board, bottom side, seen from below]

Size 110.47 x 94.92 mm. Coordinates in mm from the lower left corner, seen from the top.
Outline: 0,0 110.47,0 110.47,94.92 0,94.92 0,0
Copper layers (1*16): Top 0.035mm / dielectric 1.5mm / Bottom 0.035mm
Design rules "default": minimum track width 6mil, minimum drill 0.35mm, track to track 6mil, track to pad 6mil, pad to pad 6mil, via to via 6mil, smd to smd 6mil, copper to edge 40mil, drill to drill 6mil, minimum pad ring 10mil, minimum via ring 8mil, stop-mask expansion 4mil, vias tented up to drill 0mil, thermal gap 10mil

### Footprints (pad centres in the part's own frame; a part is rotated, then mirrored left to right if it is on the bottom)
CR1220 = smd 3.2 x 3.2: +$1 -8.225,0; +$2 8.225,0 | smd 6.35 x 6.35: - 0,0
BATTERY_18650-HOLDER = drill 1.829: GND@1 30.628,0.01; GND@2 23.88,2.55; GND@3 23.88,-2.53; PWR@1 -30.628,-0.01; PWR@2 -23.88,2.53; PWR@3 -23.88,-2.55
0805@1 = smd 1.3 x 1.5: 1 -0.95,0; 2 0.95,0
PANASONIC_D = smd 3 x 1.4: + 2.4,0; - -2.4,0
C0805 = smd 1.2 x 1.3: 1 -1.016,0; 2 1.016,0
USB-MINIB = smd 0.5 x 2.308: D+ 0,4.064; D- -0.8,4.064; GND 1.6,4.064; ID 0.8,4.064; VBUS -1.6,4.064 | smd 2 x 2.4: GND1 -4.4,-2; GND2 -4.4,3.5; GND3 4.4,3.5; GND4 4.4,-2 | hole 1: -2.2,1; 2.2,1
SOD-123 = smd 1.4 x 1.4: A 1.85,0; C -1.85,0
SOD-323 = smd 1.35 x 0.8: A 1.27,0; C -1.27,0
SOT23 = smd 1 x 1.4: 1 -0.95,-1.1; 2 0.95,-1.1; 3 0,1.1
0805-NO = smd 1.24 x 1.5: 1 -0.95,0; 2 0.95,0
TQFP100 = smd 1.5 x 0.35: 1 -8,6; 2 -8,5.5; 3 -8,5; 4 -8,4.5; 5 -8,4; 6 -8,3.5; 7 -8,3; 8 -8,2.5; 9 -8,2; 10 -8,1.5; 11 -8,1; 12 -8,0.5; 13 -8,0; 14 -8,-0.5; 15 -8,-1; 16 -8,-1.5; 17 -8,-2; 18 -8,-2.5; 19 -8,-3; 20 -8,-3.5; 21 -8,-4; 22 -8,-4.5; 23 -8,-5; 24 -8,-5.5; 25 -8,-6; 51 8,-6; 52 8,-5.5; 53 8,-5; 54 8,-4.5; 55 8,-4; 56 8,-3.5; 57 8,-3; 58 8,-2.5; 59 8,-2; 60 8,-1.5; 61 8,-1; 62 8,-0.5; 63 8,0; 64 8,0.5; 65 8,1; 66 8,1.5; 67 8,2; 68 8,2.5; 69 8,3; 70 8,3.5; 71 8,4; 72 8,4.5; 73 8,5; 74 8,5.5; 75 8,6 | smd 0.35 x 1.5: 26 -6,-8; 27 -5.5,-8; 28 -5,-8; 29 -4.5,-8; 30 -4,-8; 31 -3.5,-8; 32 -3,-8; 33 -2.5,-8; 34 -2,-8; 35 -1.5,-8; 36 -1,-8; 37 -0.5,-8; 38 0,-8; 39 0.5,-8; 40 1,-8; 41 1.5,-8; 42 2,-8; 43 2.5,-8; 44 3,-8; 45 3.5,-8; 46 4,-8; 47 4.5,-8; 48 5,-8; 49 5.5,-8; 50 6,-8; 76 6,8; 77 5.5,8; 78 5,8; 79 4.5,8; 80 4,8; 81 3.5,8; 82 3,8; 83 2.5,8; 84 2,8; 85 1.5,8; 86 1,8; 87 0.5,8; 88 0,8; 89 -0.5,8; 90 -1,8; 91 -1.5,8; 92 -2,8; 93 -2.5,8; 94 -3,8; 95 -3.5,8; 96 -4,8; 97 -4.5,8; 98 -5,8; 99 -5.5,8; 100 -6,8
SOIC8_150MIL = smd 0.6 x 2.2: 1 -1.905,-2.6; 2 -0.635,-2.6; 3 0.635,-2.6; 4 1.905,-2.6; 5 1.905,2.6; 6 0.635,2.6; 7 -0.635,2.6; 8 -1.905,2.6
TO252 = smd 1 x 1.6: 1 -2.28,-4.8; 2 2.28,-4.8 | smd 5.4 x 6.2: 3 0,2.5
LGA8 = smd 1.9 x 0.6: P$1 -1.5,1.875; P$2 -1.5,0.625; P$3 -1.5,-0.625; P$4 -1.5,-1.875; P$5 1.5,-1.875; P$6 1.5,-0.625; P$7 1.5,0.625; P$8 1.5,1.875
SO16 = smd 0.66 x 2.032: 1 -4.445,-3.073; 2 -3.175,-3.073; 3 -1.905,-3.073; 4 -0.635,-3.073; 5 0.635,-3.073; 6 1.905,-3.073; 7 3.175,-3.073; 8 4.445,-3.073; 9 4.445,3.073; 10 3.175,3.073; 11 1.905,3.073; 12 0.635,3.073; 13 -0.635,3.073; 14 -1.905,3.073; 15 -3.175,3.073; 16 -4.445,3.073
SOT23-5L = smd 0.55 x 1.2: 1 -0.95,-1.3; 2 0,-1.3; 3 0.95,-1.3; 4 0.95,1.3; 5 -0.95,1.3
2X3 = drill 1.016 pad 1.88: 1 0,0; 2 0,2.54; 3 2.54,0; 4 2.54,2.54; 5 5.08,0; 6 5.08,2.54
1X02 = drill 1.016 pad 1.88: 1 0,0; 2 2.54,0
CHIPLED_0805 = smd 1.2 x 1.2: A 0,-1.05; C 0,1.05
CRYSTAL_8X3.8 = smd 1.3 x 1.9: P$1 -2.75,-1.6; P$2 2.75,-1.6; P$3 2.75,1.6; P$4 -2.75,1.6
SOT23-WIDE = smd 1 x 1.2: 1 -0.95,-1; 2 0.95,-1; 3 0,1
DTSM-6 = smd 1.55 x 1.3: 1 -3.975,2.25; 2 3.975,2.25; 3 -3.975,-2.25; 4 3.975,-2.25
SSOP28DB = smd 0.348 x 1.397: 1 -4.225,-3.656; 2 -3.575,-3.656; 3 -2.925,-3.656; 4 -2.275,-3.656; 5 -1.625,-3.656; 6 -0.975,-3.656; 7 -0.325,-3.656; 8 0.325,-3.656; 9 0.975,-3.656; 10 1.625,-3.656; 11 2.275,-3.656; 12 2.925,-3.656; 13 3.575,-3.656; 14 4.225,-3.656; 15 4.225,3.656; 16 3.575,3.656; 17 2.925,3.656; 18 2.275,3.656; 19 1.625,3.656; 20 0.975,3.656; 21 0.325,3.656; 22 -0.325,3.656; 23 -0.975,3.656; 24 -1.625,3.656; 25 -2.275,3.656; 26 -2.925,3.656; 27 -3.575,3.656; 28 -4.225,3.656
SOT23-5 = smd 0.55 x 1.2: 1 -0.95,-1.3; 2 0,-1.3; 3 0.95,-1.3; 4 0.95,1.3; 5 -0.95,1.3
FGPMMOPA6H = smd 2 x 1: P$1 -8,6.75; P$2 -8,5.25; P$3 -8,3.75; P$4 -8,2.25; P$5 -8,0.75; P$6 -8,-0.75; P$7 -8,-2.25; P$8 -8,-3.75; P$9 -8,-5.25; P$10 -8,-6.75; P$11 8,-6.75; P$12 8,-5.25; P$13 8,-3.75; P$14 8,-2.25; P$15 8,-0.75; P$16 8,0.75; P$17 8,2.25; P$18 8,3.75; P$19 8,5.25; P$20 8,6.75 | hole 3: 0.2,0.8
BNO055 = smd 0.25 x 0.475: 1 -2.25,1.562; 6 -2.25,-1.562; 7 -1.75,-1.562; 8 -1.25,-1.562; 9 -0.75,-1.562; 10 -0.25,-1.562; 11 0.25,-1.562; 12 0.75,-1.562; 13 1.25,-1.562; 14 1.75,-1.562; 15 2.25,-1.562; 20 2.25,1.562; 21 1.75,1.562; 22 1.25,1.562; 23 0.75,1.562; 24 0.25,1.562; 25 -0.25,1.562; 26 -0.75,1.562; 27 -1.25,1.562; 28 -1.75,1.562 | smd 0.375 x 0.25: 2 -2.312,0.75; 3 -2.312,0.25; 4 -2.312,-0.25; 5 -2.312,-0.75; 16 2.312,-0.75; 17 2.312,-0.25; 18 2.312,0.25; 19 2.312,0.75
U.FL = smd 2.2 x 0.85: P$1 0,1.375; P$2 0,-1.375 | smd 1.05 x 1: P$3 1.525,0; P$4 -1.525,0
RW-SH = drill 1.5: 1 -6.1,6; 2 -6.1,-6; COM -8.1,0; NC 6.1,6; NO 6.1,-6
MICROSD = smd 0.7 x 1.5: 1 9,-10.64; 2 7.9,-10.24; 3 6.8,-10.64; 4 5.7,-11.04; 5 4.6,-10.64; 6 3.5,-11.04; 7 2.4,-10.64; 8 1.3,-10.64 | smd 1.8 x 1.4: CD1 2,-0.44; CD2 8,-0.44 | smd 1.4 x 1.9: MT1 0.4,-13.54; MT2 13.6,-14.44
XBEE-PRO = drill 0.8 pad 1.27: 1 -11,9; 2 -11,7; 3 -11,5; 4 -11,3; 5 -11,1; 6 -11,-1; 7 -11,-3; 8 -11,-5; 9 -11,-7; 10 -11,-9; 11 11,-9; 12 11,-7; 13 11,-5; 14 11,-3; 15 11,-1; 16 11,1; 17 11,3; 18 11,5; 19 11,7; 20 11,9
HC49US = drill 0.7 pad 1.651: 1 -2.54,0; 2 2.54,0

### Placement (x,y rotation side)
B1  10.79,6.35 180 top
B2  10.79,88.27 0 top
BT1  55.88,46.99 180 top
BT2  55.88,66.04 0 top
BT3  55.88,85.09 180 top
BT4  10.16,46.99 270 top
BT5  55.88,8.89 180 top
BT6  55.88,27.94 0 top
C1  90.17,54.61 270 top
C2  99.69,54.61 270 top
C3  97.79,54.61 270 top
C4  87.63,92.71 180 top
C5  99.06,82.55 90 top
C6  106.05,82.55 90 top
C7  107.95,22.86 90 bottom
C8  102.23,67.94 0 top
C9  10.79,43.81 180 top
C10  10.16,37.47 180 top
C11  59.69,38.1 90 bottom
C12  54.61,38.1 90 bottom
C13  95.89,54.61 90 top
C14  53.34,27.94 180 bottom
C15  101.6,54.61 90 top
C16  104.14,66.04 0 top
C17  100.97,73.66 0 top
C18  102.23,69.85 0 top
C21  20.32,60.33 0 top
C22  91.44,78.74 180 top
C23  100.97,75.56 180 top
C24  100.97,77.47 180 top
C25  92.08,54.61 90 top
C26  16.51,65.41 180 top
C27  93.98,54.61 90 top
C28  14.61,37.47 180 top
C29  10.79,41.27 180 top
CN2  4.45,30.48 90 bottom
D1  17.14,67.31 0 top
D2  5.08,37.47 0 top
D3  91.44,76.83 0 top
D4  80.01,74.3 0 bottom
D5  2.54,83.82 90 top
D6  40.01,53.34 90 bottom
D7  40.01,46.99 90 bottom
D8  40.01,50.16 90 bottom
D9  40.01,43.81 90 bottom
FB1  91.44,65.41 270 top
IC1  55.24,50.8 0 bottom
IC2  60.33,26.04 270 bottom
IC3  6.99,57.15 270 bottom
IC4  106.68,74.93 0 top
IC5  26.04,40.01 90 bottom
IC6  15.88,54.61 90 top
IC7  6.99,64.14 270 bottom
ICSP  99.06,24.13 0 top
IGNITER_1  107.31,31.75 90 top
IGNITER_2  107.31,38.73 90 top
IGNITER_3  107.31,45.72 90 top
IGNITER_4  107.31,55.88 270 top
LED1  3.17,92.08 270 bottom
LED2  3.17,89.53 270 bottom
LED3  3.17,87 90 bottom
LED4  3.17,84.45 90 bottom
LED5  33.66,40.64 90 bottom
LED6  3.17,81.92 90 bottom
Q1  67.31,26.04 90 bottom
Q2  97.16,69.22 0 top
Q3  100.33,62.87 90 top
Q4  97.16,61.59 270 top
Q5  92.71,69.22 0 top
R1  53.34,29.84 180 bottom
R3  107.95,19.05 270 bottom
R4  7.62,92.08 180 bottom
R5  7.62,89.53 180 bottom
R6  97.16,43.81 270 top
R7  91.44,49.53 270 top
R8  7.62,87 180 bottom
R9  7.62,84.45 180 bottom
R10  93.34,43.81 90 top
R11  95.25,49.53 90 top
R12  97.16,66.04 0 top
R13  91.44,43.81 90 top
R14  104.14,64.14 0 top
R15  93.34,49.53 270 top
R16  10.79,46.35 0 top
R17  91.44,73.03 180 top
R18  92.71,81.92 90 top
R19  94.61,81.92 90 top
R20  93.98,61.59 90 top
R21  93.98,65.41 270 top
R22  91.44,74.93 180 top
R23  97.16,49.53 270 top
R24  95.25,43.81 270 top
R25  20.32,58.42 0 top
R26  7.62,81.92 0 bottom
R27  77.47,92.08 0 bottom
S1  95.89,90.17 180 top
U1  15.88,30.48 180 bottom
U2  104.14,59.69 0 top
U3  15.88,62.23 90 top
U4  68.58,81.28 0 bottom
U5  15.88,58.42 90 top
U$70  96.52,74.93 270 top
U$78  68.58,92.08 0 bottom
U$84  42.55,10.16 270 bottom
U$86  59.69,10.16 270 bottom
U$87  76.83,11.43 270 bottom
U$90  98.42,11.43 270 bottom
X1  17.14,38.73 90 bottom
XB1  46.99,78.74 0 top
Y1  57.15,33.66 180 bottom
Y2  73.66,26.04 90 bottom

### Tracks (layer width: path | path; a pad name or v marks a point on that pad's centre or on a via)
3.3V  (via drill 0.35)
  Top 0.203: Q2.1 96.19,68.19 96.19,66.05 R12.1 96.19,65.96 v96.19,64.72 | v103.12,75.39 104.46,76.72 105.17,76.72 IC4.P$1 | v103.66,73.43 104.64,73.43 105.08,72.99 IC4.P$4 105.17,72.99 105.17,71.83 103.21,69.88 C18.2 103.21,69.79 103.21,68.01 C8.2 103.12,67.92 103.12,67.74 100.46,65.08 100.46,62.76 101.26,61.96 Q3.1 | C16.2 105.08,65.96 105.08,64.19 R14.2 105.08,64.1 102.59,61.61 | 102.59,61.61 103.12,61.07 U2.5 | 102.59,61.61 102.32,61.87 101.35,61.87 Q3.1 | v19.11,28.09 19.11,30.32 27.2,38.41 v36.27,38.41 | v37.34,39.47 49.16,39.47 58.76,49.07 59.74,49.07 66.94,56.27 89.08,56.27 92.01,59.21 98.59,59.21 101.26,61.87 Q3.1
  Bottom 0.203: v103.12,75.39 103.12,73.97 v103.66,73.43 103.66,73.34 96.19,65.88 v96.19,64.72 | v19.11,28.09 19.11,27.74 18.85,27.47 18.85,26.85 U1.17 | v37.34,39.47 v36.27,38.41
5.0V  (via drill 0.35)  (3 unrouted)
  Top 0.406: v106.32,18.31 105.79,18.31 101.35,22.76 98.59,22.76 97.7,23.65 97.7,25.34 99.03,26.67 ICSP.2 | R13.1 91.48,42.85 R10.1 93.52,42.85 95.21,42.85 R24.2 | R24.2 95.39,42.85 97.08,42.85 R6.2 97.35,42.94 98.32,43.92 98.32,47.38 97.83,47.87 | R7.2 91.48,48.63 93.34,48.63 R15.2 93.52,48.63 95.21,48.63 R11.1 95.39,48.63 97.08,48.63 R23.2 97.26,48.45 97.83,47.87 | 103.52,57.56 103.66,57.43 104.64,57.43 105.08,57.87 105.08,58.32 U2.3 105.26,58.5 106.68,59.92 v106.68,71.74 | 103.52,57.56 103.21,57.87 103.21,58.32 U2.1 | C1.1 90.23,55.56 92.01,55.56 C25.2 92.28,55.56 93.97,55.56 C27.2 94.14,55.56 95.83,55.56 C13.2 96.01,55.56 C3.1 97.97,55.56 99.66,55.56 C2.1 99.83,55.56 101.52,55.56 C15.2 | 103.52,57.56 101.7,55.74 C15.2 | v106.68,76.72 106.68,77.08 107.12,77.52 107.12,81.79 106.06,82.86 106.06,84.9 C6.+ | 97.83,47.87 102.77,52.81 102.77,54.5 101.79,55.47 C15.2 | 95.21,33.43 95.21,42.67 R24.2 | 95.21,33.43 v95.21,31.11 | v9.78,92.01 9.51,92.01 5.73,88.23 | 5.73,88.23 4.53,87.03 4.53,86.5 v3.65,85.61 | v20.98,57.07 21.25,57.34 21.25,58.41 R25.2 | U3.3 17.25,63.12 17.69,63.12 18.14,62.67 18.14,61.78 17.69,61.34 17.25,61.34 U3.1 17.25,61.07 17.25,60.9 17.11,60.76 | 17.69,53.7 17.25,53.7 IC6.1 16.98,53.7 16.62,53.7 16,54.32 13.78,54.32 3.29,43.83 3.29,37.52 D2.C 3.47,37.43 4.98,37.43 9.78,32.63 v13.25,32.63 | 17.69,53.7 18.14,54.14 18.14,55.03 17.69,55.47 17.25,55.47 IC6.3 17.16,55.74 17.16,57.43 U5.1 16.98,57.52 16.62,57.52 16.18,57.96 16.18,59.83 17.11,60.76 | 17.69,53.7 17.78,53.52 17.78,45.87 22.58,41.07 34.67,41.07 37.07,38.67 37.6,38.67 37.87,38.94 44.63,38.94 v52.36,31.2 52.54,31.29 59.03,31.29 61.61,33.87 86.86,33.87 87.3,33.43 95.21,33.43
  Top 0.406: 17.11,60.76 v17.51,60.36 | 5.73,88.23 12.27,81.7 14.67,81.7 16.09,80.28 16.09,68.45 16.54,68.01 v16.54,66.67
  Bottom 0.254: IC1.10 63.29,52.35 64.11,52.35 64.77,53.01 64.77,57.78 63.76,58.8 IC1.100 61.24,60.04 60.33,60.96 52.07,60.96 51.24,60.13 IC1.80
  Bottom 0.406: v106.32,18.31 106.5,18.14 107.92,18.14 R3.2 | v106.68,71.74 v106.68,76.72 | v95.21,31.11 99.03,27.29 99.03,26.67 ICSP.2 | LED3.A 2.13,86.94 2.13,84.45 LED4.A 2.31,84.54 2.58,84.54 v3.65,85.61 | v9.78,92.01 8.62,92.01 R4.2 | 16.27,61.78 17.6,60.45 | 17.6,60.45 v20.98,57.07 | 16.27,61.78 11.82,61.78 IC7.2 | 13.38,32.76 13.34,32.8 13.34,33.07 13.69,33.43 13.69,33.52 13.6,33.6 13.6,34.05 U1.4 | 13.38,32.76 17.16,28.98 17.16,28.18 17.07,28.09 17.07,27.83 16.89,27.65 16.89,27.47 16.8,27.38 16.8,26.85 U1.20 | v52.36,31.2 52.36,29.87 R1.1 | v13.25,32.63 13.38,32.76 | v17.51,60.36 17.6,60.45 | v16.54,66.67 16.54,62.14 16.36,61.96 16.27,61.78
ALTIMETER_SCL_3.3V
  Top 0.203: R12.2 98.15,66.05 98.15,68.19 Q2.2 98.15,68.28 98.15,68.54 100.55,70.94 100.99,70.94 102.86,72.81 102.86,73.61 104.19,74.94 106.24,74.94 106.41,75.12 106.41,75.48 107.66,76.72 108.1,76.72 IC4.P$8
ALTIMETER_SDA_3.3V
  Top 0.203: Q3.2 101.35,63.83 102.86,63.83 103.12,64.1 R14.1 103.21,64.19 104.1,65.08 104.1,70.14 106.41,72.45 106.41,74.23 107.66,75.48 108.1,75.48 IC4.P$7
D0/RX  (via drill 0.35)
  Top 0.203: v8.18,38.67 8.18,42.85 6.76,44.27 6.76,46.23 v8,47.47 | v18.58,49.34 24.54,55.3 v60.98,55.3
  Bottom 0.203: v8.18,38.67 10.94,35.92 10.94,35.56 11.65,34.85 U1.1 | v8,47.47 9.87,49.34 v18.58,49.34 | v60.98,55.3 62.05,56.36 63.21,56.36 IC1.2
D1/TX  (via drill 0.35)
  Top 0.203: v14.67,32.89 21.16,32.89 27.03,38.76 35.2,38.76 v35.56,39.12 | v37.6,50.94 57.61,50.94 v61.96,55.3
  Bottom 0.203: v14.67,32.89 14.58,32.98 14.58,33.16 14.31,33.43 14.31,34.05 U1.5 | v35.56,39.12 37.25,40.8 37.25,50.58 v37.6,50.94 | v61.96,55.3 62.23,55.56 62.23,55.65 62.32,55.74 63.21,55.74 IC1.3
D10/GPS_RX
  Bottom 0.203: D4.C 81.25,74.23 81.25,73.25 75.12,67.12 75.12,54.59 64.28,43.74 62.94,43.74 62.23,44.45 62.23,45.61 62.41,45.78 63.21,45.78 IC1.23
D11/GPS_TX
  Bottom 0.203: IC1.24 63.3,45.34 64.1,45.34 74.77,56.01 74.77,75.65 75.03,75.92 76.45,75.92 76.54,76.01 U4.P$9
D14/TXD3  (via drill 0.35)
  Top 0.203: v39.47,58.23 39.47,80.19 36.01,83.66 XB1.3
  Bottom 0.203: v39.47,58.23 46.41,51.3 47.21,51.3 IC1.64
D15/RXD3  (via drill 0.35)
  Top 0.203: v47.12,58.23 47.12,74.59 36.01,85.7 XB1.2
  Bottom 0.203: v47.12,58.23 48.27,57.07 48.27,51.03 48.09,50.85 47.3,50.85 IC1.63
D30  (via drill 0.35)
  Top 0.203: v66.05,33.07 81.52,17.6 82.77,17.6 U$87.2
  Bottom 0.203: D6.3 42.23,53.34 45.52,50.05 45.52,49.78 45.96,49.34 47.21,49.34 IC1.60 47.3,49.25 48.18,49.25 48.36,49.07 56.9,49.07 66.05,39.92 v66.05,33.07
D31  (via drill 0.35)
  Top 0.203: v48.18,33.69 48.18,16.62 U$84.2
  Bottom 0.203: D7.3 41.16,47.03 44.54,47.03 46.32,48.81 47.21,48.81 IC1.59 47.3,48.81 48.09,48.81 48.9,48.01 48.9,44.54 48.18,43.83 v48.18,33.69
D32
  Bottom 0.203: D8.3 41.16,50.14 41.16,48.63 40.09,47.56 40.09,46.41 40.27,46.23 40.45,46.23 41.07,45.61 43.65,45.61 46.32,48.27 47.21,48.27 IC1.58 47.3,48.27 48.09,48.27 48.27,48.09 48.27,44.54 47.47,43.74 47.47,30.14 54.67,22.94 58.59,22.94 65.25,16.27 65.61,16.27 U$86.2
D33  (via drill 0.35)
  Top 0.203: v93.17,22.85 90.14,22.85 83.39,16.09 70.14,16.09 55.74,30.49 52.09,30.49 48.9,33.69 48.9,33.96 44.72,38.14 v44.36,38.14
  Bottom 0.203: 42.54,43.96 46.32,47.74 47.21,47.74 IC1.57 | 42.54,43.96 42.41,43.83 41.16,43.83 D9.3 | v93.17,22.85 93.7,22.31 99.3,22.31 104.01,17.6 104.37,17.6 U$90.2 | v44.36,38.14 44.36,42.14 42.54,43.96
D50/MISO  (via drill 0.35)
  Top 0.203: v23.74,53.52 31.83,53.52 32.54,54.23 52.98,54.23 v54.67,52.54
  Bottom 0.203: v23.74,53.52 9.96,53.52 4.36,47.92 4.36,41.52 4.98,40.89 5.42,40.89 5.6,41.07 6.49,41.07 X1.7 | v54.67,52.54 60.72,46.49 62.23,46.49 62.41,46.32 63.21,46.32 IC1.22
D51/MOSI
  Bottom 0.203: IC1.21 63.21,46.85 61.34,46.85 51.03,57.16 48.98,57.16 47.83,58.32 47.83,58.5 47.38,58.94 38.32,58.94 30.76,51.38 30.67,51.38 27.47,48.18 27.47,45.34 24.8,42.67 24.8,40.89 24.54,40.63 23.02,40.63 IC5.5
D52/SCK  (via drill 0.35)
  Top 0.203: v59.47,49.78 58.5,49.78 58.14,49.43 v35.2,49.43
  Bottom 0.203: v59.47,49.78 61.96,47.3 63.21,47.3 IC1.20 | v35.2,49.43 32.45,46.67 31.03,46.67 29.07,44.72 29.07,44.45 IC5.9 27.56,44.45 27.11,44.01 27.11,40.63 24.62,38.14 23.02,38.14 IC5.3
D53/SS  (via drill 0.35)
  Top 0.203: v60.1,50.49 38.14,50.49 37.87,50.23 37.34,50.23 34.76,52.81 22.58,52.81 21.07,51.3 v21.07,43.65
  Bottom 0.203: v60.1,50.49 60.1,50.14 62.41,47.83 63.21,47.83 IC1.19 | v21.07,43.65 21.51,43.2 22.94,43.2 IC5.7
GND  (23 unrouted)
  Bottom 0.254: IC1.11 63.2,51.85 62.38,51.85 60.33,53.9 60.33,55.57 60.74,55.98 60.74,57.15 IC1.99 60.7,58.85 60.7,59.67 60.04,60.33 52.07,60.33 51.74,60 IC1.81
  pour Top: 0,0 0,94.61 110.49,94.61 110.49,0
  pour Bottom: 0,0 0,94.61 110.49,94.61 110.49,0
IMU_I2CADDR_3V
  Top 0.203: U$70.17 96.28,72.54 96.28,72.45 95.92,72.1 93.34,72.1 92.46,72.99 R17.1
IMU_NRESET_3V
  Top 0.203: U$70.11 94.94,74.68 92.63,74.68 92.46,74.85 R22.1 92.37,75.03 92.63,75.3 92.63,76.81 D3.A
IMU_SCL_3V  (via drill 0.35)
  Top 0.203: v94.94,70.41 95.3,70.41 97.26,72.36 97.26,72.54 U$70.19 | v93.97,69.43 93.97,68.54 93.7,68.28 Q5.2 93.7,68.19 93.97,67.92 93.97,66.41 R21.1
  Bottom 0.203: v93.97,69.43 v94.94,70.41
IMU_SDA_3V
  Top 0.203: U$70.20 98.06,72.63 98.06,69.61 97.52,69.08 97.43,69.08 97.17,68.81 97.17,61.7 96.19,60.72 Q4.2 96.1,60.63 94.06,60.63 R20.1
N$15
  Bottom 0.203: BT2.GND@1 86.5,67.21 85.7,68.01 85.7,82.94 86.5,83.74 86.5,85.08 BT3.PWR@1
N$16  (via drill 0.35)
  Top 0.203: v20.89,26.85 11.2,26.85 9.51,28.54 9.51,29.78 v10.22,30.49
  Bottom 0.203: v20.89,26.85 20.18,26.85 U1.15 | v10.22,30.49 10.13,30.58 9.78,30.58 9.6,30.4 8.53,30.4 CN2.D+
N$17
  Bottom 0.203: U1.16 19.47,26.76 19.47,26.14 19.29,25.96 19.29,25.6 19.47,25.43 19.2,25.16 12.89,25.16 12.8,25.25 11.2,25.25 10.58,25.87 10.58,28.18 10.94,28.54 10.94,29.07 10.22,29.78 9.78,29.78 9.6,29.6 8.53,29.6 CN2.D-
N$19
  Bottom 0.203: LED1.A 4.27,92.1 6.67,92.1 R4.1
N$20
  Bottom 0.203: LED2.A 4.27,89.52 R5.1
N$21
  Bottom 0.203: LED3.C 4.27,87.03 6.67,87.03 R8.1
N$22  (via drill 0.35)
  Top 0.203: v2.22,46.67 2.22,74.85 v4.09,76.72
  Bottom 0.203: v2.22,46.67 1.69,46.14 1.69,38.05 2.31,37.43 8.8,37.43 10.58,35.65 10.58,32.63 15.11,28.09 15.11,27.91 15.38,27.65 15.38,27.56 15.47,27.47 15.47,26.85 U1.22 | v4.09,76.72 4.09,78.32 5.96,80.19 9.6,80.19 10.22,80.81 10.22,83.57 9.6,84.19 8.89,84.19 8.62,84.45 R9.2
N$23  (via drill 0.35)
  Top 0.203: v11.82,30.32 11.38,30.32 5.25,36.45 2.4,36.45 2.22,36.63 2.22,45.7 4.09,47.56 v4.09,75.74
  Bottom 0.203: v11.82,30.32 12.36,30.32 14.58,28.09 14.58,27.83 14.85,27.56 14.85,26.85 U1.23 | v4.09,75.74 8.89,75.74 9.25,75.39 11.11,75.39 12.45,76.72 12.45,83.92 9.78,86.59 8.98,86.59 8.62,86.94 R8.2
N$24
  Bottom 0.203: R9.1 LED4.C
N$27
  Bottom 0.203: C11.1 59.65,37.07 59.65,35.38 59.92,35.12 59.92,34.94 59.83,34.85 59.83,34.49 59.74,34.4 59.74,33.69 Y1.2
N$31  (via drill 0.35)
  Top 0.203: v43.38,13.6 71.12,13.6 73.25,15.73 85.08,15.73 v91.48,22.14
  Bottom 0.203: v43.38,13.6 38.67,18.31 35.92,18.31 29.78,24.45 29.78,26.58 26.23,30.14 25.69,30.14 20,35.83 13.25,35.83 12.8,35.38 12.8,35.29 12.36,34.85 12.36,34.14 U1.2 | v91.48,22.14 92.9,23.56 97.08,23.56 97.97,22.67 98.32,22.67 98.59,22.94 99.21,22.94 102.59,19.56 106.59,19.56 107.12,19.02 108.81,19.02 108.99,19.2 108.99,20.8 107.92,21.87 C7.1
N$32  (via drill 0.35)
  Top 0.203: v55.92,36.8 55.92,34.94 54.67,33.69 Y1.1
  Bottom 0.203: v55.92,36.8 55.65,37.07 54.67,37.07 C12.1
N$33
  Bottom 0.203: R1.2 54.32,29.78 54.32,28 C14.2 54.41,28 57.7,28 IC2.8
N$34
  Bottom 0.203: X1.3 6.58,45.52 7.56,45.52 7.64,45.43 11.2,45.43 14.13,42.49 18.22,42.49 21.34,39.38 22.94,39.38 IC5.4
N$35
  Top 0.203: C17.2 101.97,73.7 102.41,73.7 104.19,75.48 105.17,75.48 IC4.P$2
N$36
  Bottom 0.203: X1.5 6.58,43.38 11.29,43.38 17.78,36.89 22.94,36.89 IC5.2
N$38
  Bottom 0.203: Q1.P$1 65.7,23.29 65.7,25.78 63.56,27.91 62.94,27.91 IC2.1
N$39
  Bottom 0.203: IC2.2 61.7,26.67 61.61,26.58 61.52,26.58 60.81,25.87 60.81,23.47 62.5,21.78 68.01,21.78 68.9,22.67 68.9,23.2 Q1.P$4
N$40  (via drill 0.35)
  Top 0.203: v61.96,23.29 61.96,22.58 53.7,14.31 43.12,14.31 v36.45,7.64 | v35.2,6.4 35.2,4.71 34.94,4.45 34.94,3.29 34.76,3.11 22.23,3.11 19.02,6.31 B1.+$1 18.94,6.4 15.56,9.78 9.34,9.78 5.96,6.4 2.58,6.4 B1.+$2
  Bottom 0.203: v61.96,23.29 61.52,23.74 61.52,24.54 62.32,25.34 62.85,25.34 IC2.3 | v35.2,6.4 v36.45,7.64
N$42  (via drill 0.35)
  Top 0.203: v9.42,47.65 10.49,47.65 11.73,46.41 R16.2
  Bottom 0.203: X1.2 6.93,46.67 8.45,46.67 v9.42,47.65 9.51,47.65 12.18,44.98 16.27,44.98 19.29,41.96 22.94,41.96 IC5.6
N$43  (via drill 0.35)
  Top 0.203: v34.4,39.47 17.78,39.47 11.91,45.34 10.85,45.34 9.87,46.32 R16.1
  Bottom 0.203: v34.4,39.47 34.67,39.74 34.67,40.63 LED5.C
N$44
  Bottom 0.203: LED5.A 32.54,40.72 32.54,41.6 32,42.14 31.56,42.14 30.49,43.2 30.32,43.2 30.23,43.12 29.16,43.12 IC5.10
N$45  (via drill 0.35)
  Top 0.203: U$70.27 98.15,76.19 98.77,76.19 100.01,77.43 C24.2 100.01,77.34 100.99,76.36 100.99,72.81 98.77,70.59 v98.77,70.14
  Bottom 0.203: v98.77,70.14 94.59,65.96 94.59,51.47 77.52,34.4 77.52,28.27 75.3,26.05 75.3,23.29 Y2.P$4
N$46
  Top 0.203: U$70.9 94.94,75.74 94.59,75.74 93.7,76.63 93.7,77.43 92.46,78.68 C22.1
N$47  (via drill 0.35)
  Top 0.203: 98.77,75.65 99.92,75.65 C23.2 | 98.77,75.65 98.15,75.65 U$70.26 | v98.77,71.56 98.77,75.65
  Bottom 0.203: v98.77,71.56 98.77,71.12 88.81,61.16 88.81,46.23 77.08,34.49 77.08,28.54 72.1,23.56 72.1,23.29 Y2.P$1
N$48
  Top 0.203: U$70.6 94.94,77.25 94.94,78.68 92.72,80.9 R18.1
N$49
  Top 0.203: U$70.5 95.75,77.25 95.75,79.83 94.68,80.9 R19.1
N$50
  Top 0.203: U5.3 17.25,59.3 18.49,59.3 19.29,58.5 R25.1
N$51
  Bottom 0.203: LED6.C 4.27,81.97 6.67,81.97 R26.2
N$52  (via drill 0.35)
  Top 0.203: v76.63,89.08 76.63,79.74 77.08,79.3 81.7,79.3 90.41,70.59 90.41,65.52 91.39,64.54 FB1.2
  Bottom 0.203: U4.P$1 76.63,88.1 v76.63,89.08 76.63,89.17 76.54,89.26 76.54,92.01 R27.2
N$53
  Bottom 0.203: U$78.P$3 67.03,92.01 66.05,92.01 62.59,88.54 62.59,75.12 62.14,74.68 60.72,74.68 60.63,74.59 U4.P$11
N$54  (via drill 0.35)
  Top 0.203: D5.C 5.69,85.7 v5.69,85.79 | v12.89,92.01 71.21,92.01 v71.39,91.83
  Bottom 0.203: v5.69,85.79 5.87,85.97 7.47,85.97 7.64,86.14 7.64,87.83 8.27,88.46 9.34,88.46 v12.89,92.01 | v71.39,91.83 74.59,88.63 74.59,84.1 75.03,83.66 76.45,83.66 76.54,83.57 U4.P$4
N$55
  Top 0.203: D5.A 2.58,85.17 2.58,88.19 B2.+$1 2.67,88.28 7.11,92.72 11.2,92.72 15.65,88.28 18.94,88.28 B2.+$2
N$56
  Bottom 0.203: U4.P$10 76.63,74.5 76.81,74.32 78.68,74.32 D4.A 78.68,74.41 78.94,74.68 78.94,75.12 82.06,78.23 82.06,89.26 79.3,92.01 78.5,92.01 R27.1
N$57  (via drill 0.35)
  Top 0.203: v21.78,76.99 32.45,76.99 35.03,79.57 35.03,86.14 35.56,86.68 70.59,86.68 v75.03,82.23
  Bottom 0.203: v21.78,76.99 19.82,75.03 3.82,75.03 2.13,76.72 2.13,81.88 LED6.A | v75.03,82.23 75.21,82.06 76.54,82.06 U4.P$5
N$58
  Bottom 0.203: BT1.GND@1 25.25,47.03 25.25,48.27 24.54,48.98 24.54,64.1 25.25,64.81 25.25,65.96 BT2.PWR@1
N$59  (via drill 0.35)
  Top 0.203: v15.11,15.65 35.2,15.65 36.01,14.85 50.32,14.85 53.78,18.31 v56.72,18.31
  Bottom 0.203: v15.11,15.65 12.18,15.65 11.47,16.36 10.22,16.36 BT4.GND@1 | v56.72,18.31 61.34,13.69 80.99,13.69 85.7,8.98 86.5,8.98 BT5.PWR@1
N$60  (via drill 0.35)
  Top 0.61: v21.07,62.5 19.02,64.54 19.02,67.3 D1.A | v22.49,61.07 23.82,61.07 27.56,57.34 v76.63,57.34
  Bottom 0.61: v22.49,61.07 v21.07,62.5 | v76.63,57.34 86.5,47.47 86.5,47.03 BT1.PWR@1
N$61
  Bottom 0.203: BT5.GND@1 25.34,8.89 25.34,10.13 26.05,10.85 26.05,25.78 25.25,26.58 25.25,27.91 BT6.PWR@1
N$62  (via drill 0.35)
  Top 0.61: v87.21,3.73 93.08,3.73 107.21,17.87 107.21,28.45 108.72,29.96 108.72,32.36 107.39,33.69 107.39,34.23 IGNITER_1.2
  Bottom 0.61: v87.21,3.73 85.43,1.96 74.85,1.96 71.56,5.25 70.85,5.25 U$87.NC
N$63
  Bottom 0.203: IC3.2 11.82,54.94 11.82,56.9 9.51,59.21 9.51,66.67 11.47,68.63 14.4,68.63 31.11,85.34 33.07,85.34 35.38,87.66 35.92,87.66 XB1.1
N$64  (via drill 0.35)
  Top 0.61: v108.1,28.09 108.1,6.76 102.95,1.6 39.03,1.6 36.63,4 U$84.NC
  Bottom 0.61: v108.1,28.09 105.35,30.85 105.35,39.92 106.68,41.25 107.3,41.25 IGNITER_2.2
N$65
  Top 0.203: IGNITER_3.2 107.39,48.27 107.39,50.58 109.35,52.54 109.35,55.56 107.84,57.07 106.77,57.07 103.3,53.61 103.3,49.25 98.86,44.81 98.86,33.78 93.88,28.8 93.88,22.58 85.97,14.67 72.72,14.67 62.14,4.09 53.7,4.09 U$86.NC
N$66
  Top 0.61: IGNITER_4.2 107.3,52.45 99.48,44.63 99.48,33.6 94.5,28.63 94.5,7.38 92.46,5.33 U$90.NC
OUT
  Top 0.203: U5.5 14.49,57.52 14.49,58.14 13.69,58.94 13.69,60.45 14.49,61.25 U3.5 14.58,61.34 14.58,61.87 16.62,63.92 16.62,64.36 | 16.62,64.36 17.25,64.36 19.29,62.32 19.29,60.36 C21.1 19.38,60.27 20.36,59.3 20.36,57.43 20.27,57.34 20.27,56.81 20.71,56.36 66.5,56.36 66.76,56.63 88.1,56.63 93.97,62.5 R20.2 | 16.62,64.36 15.65,65.34 C26.2 | Q4.1 96.1,62.59 94.06,62.59 R20.2 | R20.2 94.06,62.67 94.06,64.45 R21.2 93.97,64.54 91.83,66.67 FB1.1 91.48,66.41 91.75,66.67 91.75,68.19 Q5.1 91.75,68.28 91.75,71.83 91.48,72.1 91.48,73.88 90.5,74.85 R22.2 90.5,74.94 91.48,75.92 91.48,81.52 91.83,81.88 95.48,81.88 97.08,80.28 97.08,77.79 | 96.63,77.25 96.72,77.25 U$70.3 | 96.63,77.25 96.28,77.25 U$70.4 | 97.08,77.79 98.23,77.79 98.59,77.43 98.59,76.9 98.41,76.72 98.15,76.72 U$70.28 | 97.08,77.79 96.63,77.34 96.63,77.25
RESET  (via drill 0.35)
  Top 0.203: C4.1 88.63,92.63 91.66,92.63 91.83,92.46 S1.4 91.92,92.46 99.83,92.46 S1.3 99.92,92.37 99.92,89.7 103.12,86.5 v103.12,76.36 | v60.45,40.8 87.48,40.8 v94.06,34.23
  Bottom 0.203: v60.45,40.8 59.3,41.96 59.3,42.76 IC1.30 | 105.26,22.67 105.26,21.69 106.95,20 107.92,20 R3.1 | 105.26,22.67 104.19,23.74 104.19,24.09 ICSP.5 104.1,24.18 102.95,25.34 101.17,25.34 100.37,26.14 100.37,27.2 100.64,27.47 100.64,27.65 v94.06,34.23 94.06,34.31 96.01,36.27 96.01,63.83 95.48,64.36 95.48,65.7 99.48,69.7 99.48,72.72 v103.12,76.36 | C7.2 107.92,23.74 106.41,23.74 105.35,22.67 105.26,22.67
SCL  (via drill 0.35)
  Top 0.203: 95.3,69.7 96.63,69.7 97.08,70.14 Q2.3 | 95.3,69.7 94.68,69.7 94.23,70.14 92.72,70.14 Q5.3 | 57.61,41.52 76.81,41.52 77.17,41.16 89.17,41.16 90.41,42.41 90.41,43.74 91.39,44.72 R13.2 91.48,44.81 93.34,44.81 R10.2 93.43,44.81 95.21,44.81 R24.1 | 57.61,41.52 v53.16,41.52 | R6.1 97.08,44.81 95.3,44.81 R24.1 | 57.61,41.52 v57.61,32.09 | v95.3,63.56 95.3,69.7 | v95.3,47.38 95.3,44.9 R24.1
  Bottom 0.203: v53.16,41.52 52.81,41.87 52.81,42.76 IC1.43 | v57.61,32.09 57.61,29.87 59.12,28.36 59.12,26.23 58.32,25.43 57.78,25.43 IC2.6 | v95.3,47.38 v95.3,63.56
SDA  (via drill 0.35)
  Top 0.203: Q3.3 99.3,62.85 98.23,61.78 98.23,61.61 Q4.3 98.15,61.52 v98.15,59.92 | v98.15,52.45 98.15,51.38 97.26,50.49 R23.1 97.08,50.49 95.3,50.49 R11.2 95.21,50.49 93.43,50.49 R15.1 93.34,50.49 91.48,50.49 R7.1 91.48,50.58 89.26,52.81 64.01,52.81 53.43,42.23 52.9,42.23 v52.18,41.52
  Bottom 0.203: v98.15,52.45 v98.15,59.92 | 52.27,41.52 52.27,36.89 53.78,35.38 55.3,35.38 59.65,31.03 59.65,24.71 59.03,24.09 57.78,24.09 IC2.5 | 52.27,41.52 52.27,42.76 IC1.44 | v52.18,41.52 52.27,41.52
SPARKGAP+  (via drill 0.35)
  Top 0.61: U$90.NO 104.37,5.25 95.75,5.25 93.34,2.85 v80.1,2.85 67.03,2.85 65.96,3.91 U$86.NO 65.61,4 64.01,2.4 53.07,2.4 51.47,4 48.63,4 U$84.NO 48.27,4.18 38.67,4.18 35.56,7.29 35.56,14.13 34.76,14.94 22.58,14.94 19.82,12.18 5.6,12.18 1.33,16.45 1.33,75.21 4.53,78.41 v5.16,78.41
  Bottom 0.61: v80.1,2.85 82.5,5.25 82.77,5.25 U$87.NO | v5.16,78.41 7.91,78.41 8.36,77.97 8.45,77.97 8.53,77.88 8.8,77.88 8.98,77.7 10.13,77.7 BT4.PWR@1
SPARKGAP-  (via drill 0.35)
  Top 0.61: 105.88,33.69 107.3,32.27 107.3,31.83 IGNITER_1.1 | 105.88,33.69 105.88,37.25 107.3,38.67 IGNITER_2.1 107.39,39.03 108.72,40.36 108.72,41.87 107.39,43.2 107.39,45.7 IGNITER_3.1 107.12,45.96 105.88,47.21 105.88,49.87 108.72,52.72 108.72,53.96 107.39,55.3 107.39,55.83 IGNITER_4.1 | v95.39,28.27 100.28,28.27 105.61,33.6 105.88,33.69
  Bottom 0.61: v95.39,28.27 88.19,28.27 88.1,28.18 87.83,28.18 87.66,28 86.59,28 BT6.GND@1
VDD  (via drill 0.35)
  Top 0.203: 8.71,44.9 8.71,47.92 9.16,48.36 9.25,48.36 14.49,53.61 IC6.5 | 8.71,44.9 9.78,43.83 C9.2 C29.2 9.87,41.25 10.76,40.36 14.4,40.36 19.2,35.56 v21.34,35.56 | v7.47,44.54 8.27,44.54 8.62,44.9 8.71,44.9
  Bottom 0.203: v7.47,44.54 7.2,44.54 7.11,44.45 6.13,44.45 X1.4 | v21.34,35.56 IC5.1
VIN  (via drill 0.35)
  Top 0.406: v13.16,66.59 13.87,67.3 15.29,67.3 D1.C | v16.89,70.14 20.98,74.23 20.98,89.43 22.58,91.03 90.77,91.03 96.81,84.99 99.03,84.99 C5.+
  Bottom 0.406: IC3.1 11.73,59.47 10.4,59.47 10.05,59.83 10.05,63.92 11.47,65.34 11.47,66.14 11.65,66.32 IC7.1 11.82,66.41 12.98,66.41 v13.16,66.59 13.34,66.59 v16.89,70.14
VUSB  (via drill 0.35)
  Top 0.203: D2.A 6.93,37.52 9.16,37.52 C10.2 9.25,37.52 10.22,38.49 11.91,38.49 12.89,37.52 13.51,37.52 C28.2 13.6,37.43 13.96,37.07 13.96,31.47 11.29,28.8 v10.22,28.8
  Bottom 0.203: v10.22,28.8 8.53,28.8 CN2.VBUS
XTAL1
  Bottom 0.203: C12.2 54.67,39.03 57.87,39.03 58.76,38.14 60.54,38.14 62.32,39.92 62.32,43.12 60.9,44.54 57.7,44.54 57.25,44.09 57.25,42.85 IC1.34
XTAL2
  Bottom 0.203: C11.2 59.65,39.12 59.65,39.92 58.5,41.07 57.7,41.07 57.34,41.43 57.34,41.6 57.7,41.96 57.7,42.76 IC1.33